# Altium project M.2 Accelerator.PrjPcb (part 1 of 2)
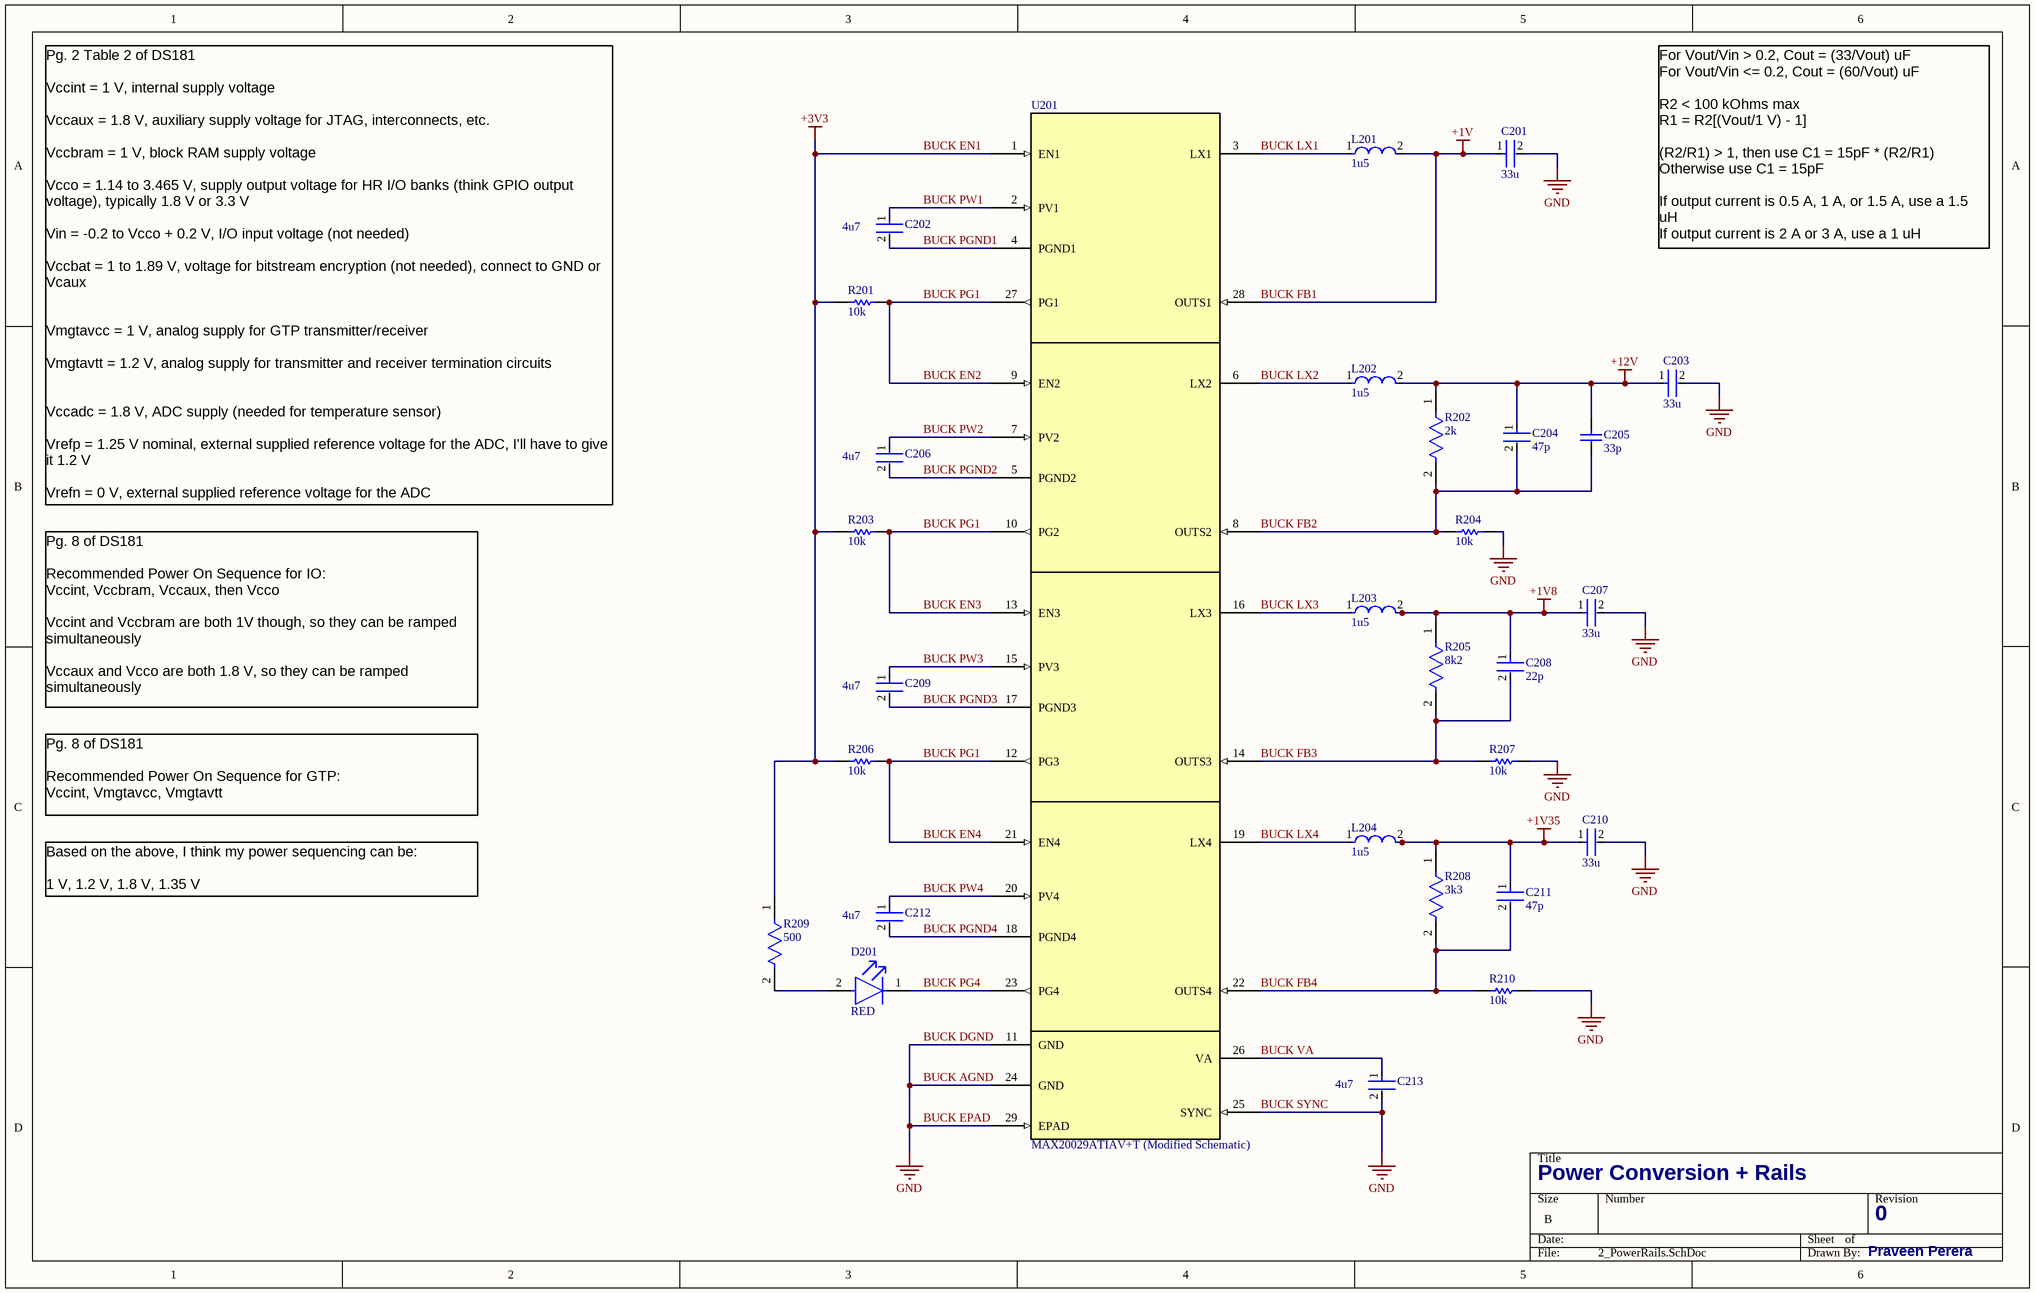
[diagram p0: 2_PowerRails.SchDoc]
9 sheets, 166 parts. Net scope: global (net labels, ports and power ports of the same name join across sheets).
Sheets:
  1_Overview.SchDoc
  2_PowerRails.SchDoc
  3_PowerDistribution.SchDoc
  4_Configuration.SchDoc
  5_GPIOBanks.SchDoc
  6_DRAMBanks.SchDoc
  7_PCIeBank.SchDoc
  8_DDR3L.SchDoc
  9_M.2_B+M.SchDoc

## Sheet 1_Overview.SchDoc
size A; SheetNumber: 1; SheetTotal: 9

## Sheet 2_PowerRails.SchDoc: Power Conversion + Rails
size B; Author: Praveen Perera; DrawnBy: Praveen Perera; Engineer: Praveen Perera; Revision: 0; SheetNumber: 2; SheetTotal: 9

### Parts
C201  33u  [FP-C2012-125-0_2-IPC_A]
C202  4u7  [FP-GCM31C-0_2-e0_3_0_8-IPC_C]
C203  33u  [FP-C2012-125-0_2-IPC_A]
C204  47p  [FP-GCQ155-0_05-MFG]
C205  33p  [CAPC1005X60X26NL10T16]
C206  4u7  [FP-GCM31C-0_2-e0_3_0_8-IPC_C]
C207  33u  [FP-C2012-125-0_2-IPC_A]
C208  22p  [FP-GJM155-0_05-IPC_A]
C209  4u7  [FP-GCM31C-0_2-e0_3_0_8-IPC_C]
C210  33u  [FP-C2012-125-0_2-IPC_A]
C211  47p  [FP-GCQ155-0_05-MFG]
C212  4u7  [FP-GCM31C-0_2-e0_3_0_8-IPC_C]
C213  4u7  [FP-GCM31C-0_2-e0_3_0_8-IPC_C]
D201  RED  [FP-SML-LX0603SIW-TR-MFG]
L201  1u5  [FP-IHLP-2525CZ-FP_2_413x3-MFG]
L202  1u5  [FP-IHLP-2525CZ-FP_2_413x3-MFG]
L203  1u5  [FP-IHLP-2525CZ-FP_2_413x3-MFG]
L204  1u5  [FP-IHLP-2525CZ-FP_2_413x3-MFG]
R201  10k  [RESC1005X40X25LL10T10]
R202  2k  [FP-MCS0402-IPC_A]
R203  10k  [RESC1005X40X25LL10T10]
R204  10k  [RESC1005X40X25LL10T10]
R205  8k2  [FP-ERA2A-MFG]
R206  10k  [RESC1005X40X25LL10T10]
R207  10k  [RESC1005X40X25LL10T10]
R208  3k3  [FP-ERA2A-MFG]
R209  500  [FP-PNM0402-MFG]
R210  10k  [RESC1005X40X25LL10T10]
U201  MAX20029ATIAV+T (Modified Schematic)  [21-0140L_T2855-5_MXM]

### Nets
+1V8: C207.1 C208.1 L203.2 R205.1
+1V35: C210.1 C211.1 L204.2 R208.1
+12V: C203.1 C204.1 C205.2 L202.2 R202.1
BUCK AGND: C201.2 C203.2 C207.2 C210.2 C213.2 R204.2 R207.2 R210.2 U201.11(GND) U201.24(GND) U201.25(SYNC) U201.29(EPAD)  [also labelled BUCK DGND, BUCK EPAD, BUCK SYNC, GND]
BUCK EN1: R201.1 R203.1 R206.1 R209.1 U201.1(EN1)  [also labelled +3V3]
BUCK FB1: C201.1 L201.2 U201.28(OUTS1)  [also labelled +1V]
BUCK EN2: R201.2 R203.2 R206.2 U201.9(EN2) U201.10(PG2) U201.12(PG3) U201.13(EN3) U201.21(EN4) U201.27(PG1)  [also labelled BUCK EN3, BUCK EN4, BUCK PG1]
BUCK FB2: C204.2 C205.1 R202.2 R204.1 U201.8(OUTS2)
BUCK FB3: C208.2 R205.2 R207.1 U201.14(OUTS3)
BUCK FB4: C211.2 R208.2 R210.1 U201.22(OUTS4)
BUCK LX1: L201.1 U201.3(LX1)
BUCK LX2: L202.1 U201.6(LX2)
BUCK LX3: L203.1 U201.16(LX3)
BUCK LX4: L204.1 U201.19(LX4)
BUCK PG4: D201.1(C) U201.23(PG4)
BUCK PGND1: C202.2 U201.4(PGND1)
BUCK PGND2: C206.2 U201.5(PGND2)
BUCK PGND3: C209.2 U201.17(PGND3)
BUCK PGND4: C212.2 U201.18(PGND4)
BUCK PW1: C202.1 U201.2(PV1)
BUCK PW2: C206.1 U201.7(PV2)
BUCK PW3: C209.1 U201.15(PV3)
BUCK PW4: C212.1 U201.20(PV4)
BUCK VA: C213.1 U201.26(VA)
NetD201_2: D201.2(A) R209.2

### Notes on the sheet
- For Vout/Vin > 0.2, Cout = (33/Vout) uF
  For Vout/Vin <= 0.2, Cout = (60/Vout) uF
  R2 < 100 kOhms max
  R1 = R2[(Vout/1 V) - 1]
  (R2/R1) > 1, then use C1 = 15pF * (R2/R1)
  Otherwise use C1 = 15pF
  If output current is 0.5 A, 1 A, or 1.5 A, use a 1.5 uH
  If output current is 2 A or 3 A, use a 1 uH
  If output voltage is less than 0.9 V, use a 0.47 uH
- Pg. 2 Table 2 of DS181
  Vccint = 1 V, internal supply voltage
  Vccaux = 1.8 V, auxiliary supply voltage for JTAG, interconnects, etc.
  Vccbram = 1 V, block RAM supply voltage
  Vcco = 1.14 to 3.465 V, supply output voltage for HR I/O banks (think GPIO output voltage), typically 1.8 V or 3.3 V
  Vin = -0.2 to Vcco + 0.2 V, I/O input voltage (not needed)
  Vccbat = 1 to 1.89 V, voltage for bitstream encryption (not needed), connect to GND or Vcaux
  Vmgtavcc = 1 V, analog supply for GTP transmitter/receiver
  Vmgtavtt = 1.2 V, analog supply for transmitter and receiver termination circuits
  Vccadc = 1.8 V, ADC supply (needed for temperature sensor)
  Vrefp = 1.25 V nominal, external supplied reference voltage for the ADC, I'll have to give it 1.2 V
  Vrefn = 0 V, external supplied reference voltage for the ADC
- Pg. 8 of DS181
  Recommended Power On Sequence for IO:
  Vccint, Vccbram, Vccaux, then Vcco
  Vccint and Vccbram are both 1V though, so they can be ramped simultaneously
  Vccaux and Vcco are both 1.8 V, so they can be ramped simultaneously
- Pg. 8 of DS181
  Recommended Power On Sequence for GTP:
  Vccint, Vmgtavcc, Vmgtavtt
- Based on the above, I think my power sequencing can be:
  1 V, 1.2 V, 1.8 V, 1.35 V

### Library data of the parts
C201 C203 C207 C210 = CMP-08246-002720-1: C2012X5R1A336M125AC / Multilayer Ceramic Capacitors 33μF ±20% 10V X5R SMD 0805; Capacitance: 33uF; Dielectric: X5R; Series: C; Packaging: Tape and Reel; Voltage Rating: 10V; Height: 1.25mm; Tolerance: 20%; Thickness: 0.057inch; Min Operating Temperature: -55°C; Max Operating Temperature: 85°C; Case Code (Imperial): 0805; Voltage Rating (DC): 10V; Case Code (Metric): 2012; Length: 2mm; REACH SVHC: No SVHC; Depth: 1.25mm; Package Quantity: 1; Dielectric Material: Ceramic; Lead Free: Lead Free; Case/Package: 0805; Termination: SMD/SMT; Resistor Type: Ceramic; RoHS Compliant: Yes; Width: 0.049inch; Weight: 0.000194oz; Mount: Surface Mount
C202 C206 C209 C212 C213 = CMP-06035-020722-1: GCM31CR71E475KA55K / Ceramic Capacitor for Automotive 4.7uF ±10% 25VDC X7R 1206 Embossed T/R; Voltage Rating: 25V; Case Code (Imperial): 1206; Depth: 1.6mm; Length: 3.2mm; Ratings: AEC-Q200; Capacitance: 4.7uF; Height: 1.6mm; Case/Package: 1206; Packaging: Tape and Reel; Radiation Hardening: No; Dielectric: X7R; Case Code (Metric): 3216; Termination: SMD/SMT; Package Quantity: 6000; Max Operating Temperature: 125°C; Voltage Rating (DC): 25V; Thickness: 0.071inch; Width: 0.063inch; Min Operating Temperature: -55°C; Mount: Surface Mount; Tolerance: 10%
C204 C211 = CMP-06035-040611-1: GCQ1555C1H470GB01D / High Q Ceramic Capacitor for Automotive 47pF ±2% 50VDC C0G 0402 Paper T/R
C205 = CMP-2008-01050-1: VJ0402A330JXAAC; Manufacturer: Vitramon; Part Number: VJ0402A330JXAAC
C208 = CMP-06035-061679-1: GJM1555C1H220GB01D / Multi-Layer Ceramic Capacitor 22pF C0G  ±2% 0402 Paper T/R; Voltage Rating (DC): 50V; Length: 1mm; Thickness: 500um; Tolerance: 2%; Capacitance: 22pF; RoHS Compliant: Yes; Dielectric: C0G; Width: 500um
D201 = CMP-57192-000009-1: SML-LX0603SIW-TR / LED RED DIFFUSED SMD; Test Current: 20mA; Forward Voltage: 2V; Approvals: UL; Dominant Wavelength: 636nm; Viewing Angle: 140°; Lens Color: White; Luminous Intensity: 60mcd; Power Rating: 50mW; Number of LEDs: 1; Color: Red; Forward Current: 20mA; Moisture Sensitivity Level: 2; Case Code (Imperial): 0603; Lead Free: Lead Free; Lens Transparency: Diffused; Case Code (Metric): 1608; Height: 0.6mm; Max Operating Temperature: 85°C; Width: 0.8mm; Lens Style: Diffused; Illumination Color: Red; Wavelength: 636nm; REACH SVHC: No SVHC; Package Quantity: 1; RoHS Compliant: Yes; Case/Package: 0603; Number of Pins: 2; Packaging: Tape and Reel; Length: 1.6mm; Mount: Surface Mount; Min Operating Temperature: -25°C
L201-L204 = CMP-02424-000713-1: IHLP2525CZER1R5M07 / Commercial Inductors, High Saturation Series, 5 % DCR Tolerance 1.5uH 9A 14.5mΩ 20%; DC Resistance (DCR): 14.5mR; Saturation Current: 18A; Test Frequency: 100kHz; Shielding: Shielded; Lead Free: Lead Free; Tolerance: 20%; Radiation Hardening: No; Series: IHLP-2525CZ-07; Width: 0.255inch; Length: 0.27inch; Depth: 6.72mm; Case/Package: Nonstandard; Height: 3mm; Mount: Surface Mount; Package Quantity: 2000; Current Rating: 9A; Height - Seated (Max): 0.118inch; Packaging: Tape and Reel; Inductance: 1.5uH; Max Operating Temperature: 125°C; Min Operating Temperature: -55°C
R201 R203 R204 R206 R207 R210 = CMP-2002-04584-1: SG73P1ETTP1002F; Manufacturer: KOA Speer; Part Number: SG73P1ETTP1002F
R202 = CMP-02407-003721-1: MCS0402MD2001BE100 / RES SMD 1.2K OHM 1% 1/10W 0402; Resistance: 2kR; Temperature Coefficient: 25ppm/°C; Power Rating: 63mW; Voltage Rating: 50V; Tolerance: 0.1%; Lead Free: Lead Free; Max Operating Temperature: 155°C; Case/Package: 0402; Case Code (Metric): 1005; Height: 0.32mm; Composition: Thin Film; Weight: 2.1E-05oz; Width: 0.5mm; Case Code (Imperial): 0402; Packaging: Tape and Reel; Length: 1mm; Min Operating Temperature: -55°C; Contact Plating: Tin
R205 = CMP-2002-05828-2: ERA-2AEB822X / RES SMD 8.2K OHM 0.1% 1/16W 0402; Manufacturer: Panasonic Electronic Components; Value: 8.2kΩ; Temperature Coefficient: 25ppm/°C; Voltage Rating: 50V; Automotive Grade: Grade 0; Power Rating: 0.063W; Temperature Range Low: -55°C; Lead Free: Yes; Device Class L2: Resistors; Height: 0.4mm; RoHS: TRUE; Mouser Description: Thin Film Resistors - SMD 0402 1/16W 8.2Kohms; Octopart: https://octopart.com/era-2aeb822x-panasonic-43284358; Tolerance: 0.1%; Composition: Thin Film; Package: ERA2A; Resistance: 8.2kΩ; Temperature: -55°C to +155°C; Series: ERA; Manufacturer Part Number: ERA-2AEB822X; ComponentLink2URL: https://industrial.panasonic.com/cdbs/www-data/pdf/RDM0000/AOA0000C307.pdf; Digikey Description: RES SMD 8.2K OHM 0.1% 1/16W 0402; ComponentLink2Description: Datasheet; Category: Res; Footprint Url: https://industrial.panasonic.com/cdbs/www-data/pdf/RDM0000/DMM0000COL17.pdf; Temperature Range High: +155°C; Automotive: Yes; Device Class L1: Passive Components; Device Class L3: Chip SMD Resistors
R208 = CMP-2002-05884-2: ERA-2AEB332X; NexarPartId: 9251384; Voltage Rating (DC): 25V; Temperature Coefficient: 25ppm/°C; Tolerance: 0.1%; Resistance: 3.3kΩ; Power Rating: 63mW; Case/Package: 0402; Number of Terminations: 2; Military Standard: Not; Case Code (Imperial): 0402; Length: 1mm; Contact Plating: Tin; Termination: SMD/SMT; Schedule B: 8533210045, 8533210045; Voltage Rating: 25V; Lead Free: Lead Free; Min Operating Temperature: -55°C; REACH SVHC: No SVHC; Max Power Dissipation: 63mW; Weight: 793.786648µg; RoHS: Compliant; Depth: 500µm; Packaging: Cut Tape; Max Operating Temperature: 155°C; Width: 500µm; Case Code (Metric): 1005; Height: 350µm; Composition: Thin Film; Lifecycle Status: Production; Radiation Hardening: No; Number of Pins: 2; Mount: Surface Mount
R209 = CMP-02407-011888-1: PNM0402E5000BST1 / RES SMD 500 OHM 0.1% 1/20W 0402; Temperature Coefficient: 25ppm/°C; Max Power Dissipation: 50mW; Resistance: 500R; Width: 0.022inch; Length: 0.042inch; Tolerance: 0.1%; Lead Free: Lead Free; Height: 0.033inch; Case Code (Metric): 1005; Features: Moisture Resistant; Case Code (Imperial): 0402; Max Operating Temperature: 155°C; Case/Package: 0402; Min Operating Temperature: -55°C; Package Quantity: 1000; RoHS Compliant: Yes; Packaging: Tape and Reel; Resistor Type: Thin Film; Number of Terminations: 2
U201 = CMP-010-000006-2: Automotive Quad/Triple Low-Voltage Step-Down DC-DC Converters; Manufacturer_Name: Analog Devices / Maxim Integrated; Manufacturer_Part_Number: MAX20029ATIA/V+T; Source: MAX20029ATIAV&plus_T - Modified.SchLib; RefDes: RefDes; Design Item ID: MAX20029ATIAV+T; Copyright: Copyright (C) 2025 Ultra Librarian. All rights reserved.; Pin Count: 29; Component Type: Standard; Type: Type

## Sheet 3_PowerDistribution.SchDoc
size A3; SheetNumber: 3; SheetTotal: 8
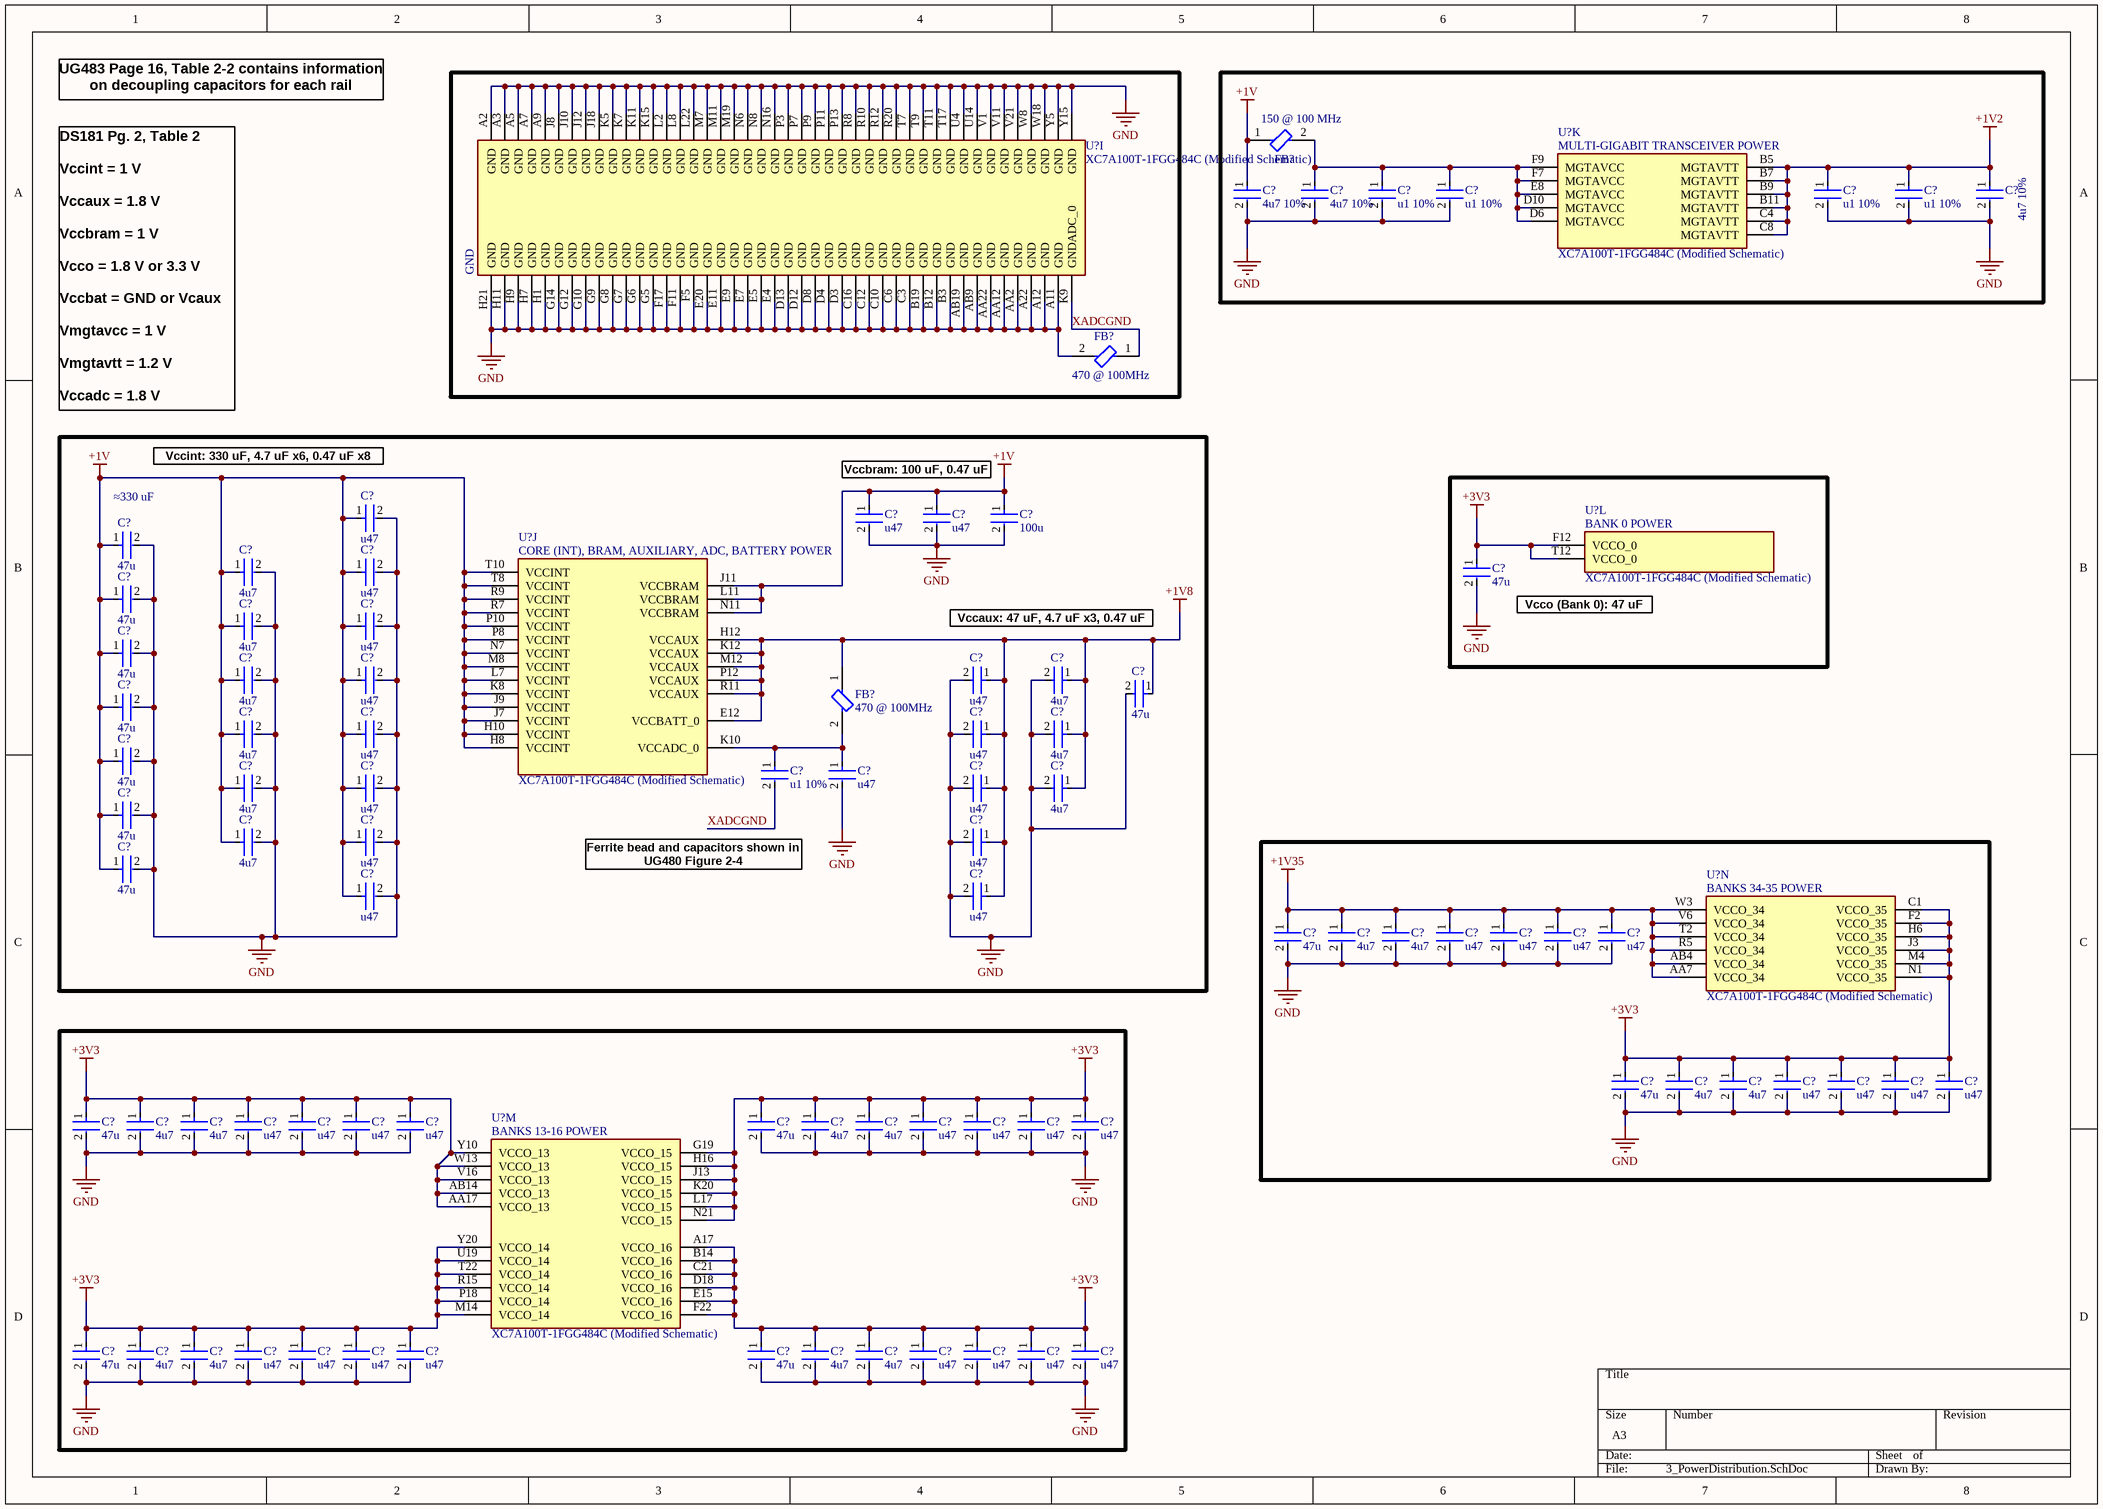
[diagram p1: 3_PowerDistribution.SchDoc]

### Parts
(Parts that share a designator on the sheet are numbered #1, #2 ... from top to bottom, then left to right.)
C?#1  4u7 10%  [FP-C1005-050-0_20-0_10-MFG]
C?#2  4u7 10%  [FP-C1005-050-0_20-0_10-MFG]
C?#3  u1 10%  [FP-CL891-IPC_C]
C?#4  u1 10%  [FP-CL891-IPC_C]
C?#5  u1 10%  [FP-CL891-IPC_C]
C?#6  u1 10%  [FP-CL891-IPC_C]
C?#7  4u7 10%  [FP-C1005-050-0_20-0_10-MFG]
C?#8  u47  [FP-C0603-030-0_03-IPC_A]
C?#9  u47  [FP-C0603-030-0_03-IPC_A]
C?#10  100u  [FP-GRM21B-0_2-e0_2_0_7-IPC_A]
C?#11  u47  [FP-C0603-030-0_03-IPC_A]
C?#12  47u  [FP-GRM188-0_2-IPC_B]
C?#13  47u  [FP-GRM188-0_2-IPC_B]
C?#14  4u7  [FP-CL829-IPC_C]
C?#15  u47  [FP-C0603-030-0_03-IPC_A]
C?#16  47u  [FP-GRM188-0_2-IPC_B]
C?#17  4u7  [FP-CL829-IPC_C]
C?#18  u47  [FP-C0603-030-0_03-IPC_A]
C?#19  47u  [FP-GRM188-0_2-IPC_B]
C?#20  4u7  [FP-CL829-IPC_C]
C?#21  u47  [FP-C0603-030-0_03-IPC_A]
C?#22  u47  [FP-C0603-030-0_03-IPC_A]
C?#23  4u7  [FP-CL829-IPC_C]
C?#24  47u  [FP-GRM188-0_2-IPC_B]
C?#25  47u  [FP-GRM188-0_2-IPC_B]
C?#26  4u7  [FP-CL829-IPC_C]
C?#27  u47  [FP-C0603-030-0_03-IPC_A]
C?#28  u47  [FP-C0603-030-0_03-IPC_A]
C?#29  4u7  [FP-CL829-IPC_C]
C?#30  47u  [FP-GRM188-0_2-IPC_B]
C?#31  u1 10%  [FP-CL891-IPC_C]
C?#32  u47  [FP-C0603-030-0_03-IPC_A]
C?#33  4u7  [FP-CL829-IPC_C]
C?#34  u47  [FP-C0603-030-0_03-IPC_A]
C?#35  u47  [FP-C0603-030-0_03-IPC_A]
C?#36  4u7  [FP-CL829-IPC_C]
C?#37  47u  [FP-GRM188-0_2-IPC_B]
C?#38  4u7  [FP-CL829-IPC_C]
C?#39  u47  [FP-C0603-030-0_03-IPC_A]
C?#40  u47  [FP-C0603-030-0_03-IPC_A]
C?#41  47u  [FP-GRM188-0_2-IPC_B]
C?#42  u47  [FP-C0603-030-0_03-IPC_A]
C?#43  u47  [FP-C0603-030-0_03-IPC_A]
C?#44  47u  [FP-GRM188-0_2-IPC_B]
C?#45  4u7  [FP-CL829-IPC_C]
C?#46  4u7  [FP-CL829-IPC_C]
C?#47  u47  [FP-C0603-030-0_03-IPC_A]
C?#48  u47  [FP-C0603-030-0_03-IPC_A]
C?#49  u47  [FP-C0603-030-0_03-IPC_A]
C?#50  u47  [FP-C0603-030-0_03-IPC_A]
C?#51  47u  [FP-GRM188-0_2-IPC_B]
C?#52  4u7  [FP-CL829-IPC_C]
C?#53  4u7  [FP-CL829-IPC_C]
C?#54  u47  [FP-C0603-030-0_03-IPC_A]
C?#55  u47  [FP-C0603-030-0_03-IPC_A]
C?#56  u47  [FP-C0603-030-0_03-IPC_A]
C?#57  u47  [FP-C0603-030-0_03-IPC_A]
C?#58  47u  [FP-GRM188-0_2-IPC_B]
C?#59  4u7  [FP-CL829-IPC_C]
C?#60  4u7  [FP-CL829-IPC_C]
C?#61  u47  [FP-C0603-030-0_03-IPC_A]
C?#62  u47  [FP-C0603-030-0_03-IPC_A]
C?#63  u47  [FP-C0603-030-0_03-IPC_A]
C?#64  u47  [FP-C0603-030-0_03-IPC_A]
C?#65  47u  [FP-GRM188-0_2-IPC_B]
C?#66  4u7  [FP-CL829-IPC_C]
C?#67  4u7  [FP-CL829-IPC_C]
C?#68  u47  [FP-C0603-030-0_03-IPC_A]
C?#69  u47  [FP-C0603-030-0_03-IPC_A]
C?#70  u47  [FP-C0603-030-0_03-IPC_A]
C?#71  u47  [FP-C0603-030-0_03-IPC_A]
C?#72  47u  [FP-GRM188-0_2-IPC_B]
C?#73  4u7  [FP-CL829-IPC_C]
C?#74  4u7  [FP-CL829-IPC_C]
C?#75  u47  [FP-C0603-030-0_03-IPC_A]
C?#76  u47  [FP-C0603-030-0_03-IPC_A]
C?#77  u47  [FP-C0603-030-0_03-IPC_A]
C?#78  u47  [FP-C0603-030-0_03-IPC_A]
C?#79  47u  [FP-GRM188-0_2-IPC_B]
C?#80  4u7  [FP-CL829-IPC_C]
C?#81  4u7  [FP-CL829-IPC_C]
C?#82  u47  [FP-C0603-030-0_03-IPC_A]
C?#83  u47  [FP-C0603-030-0_03-IPC_A]
C?#84  u47  [FP-C0603-030-0_03-IPC_A]
C?#85  u47  [FP-C0603-030-0_03-IPC_A]
FB?#1  150 @ 100 MHz  [FP-MPZ1005-IPC_B]
FB?#2  470 @ 100MHz  [FP-BLM41-0_2-a1_2-IPC_B]
FB?#3  470 @ 100MHz  [FP-BLM41-0_2-a1_2-IPC_B]
U?#1  XC7A100T-1FGG484C (Modified Schematic)  [BGA484C100P22X22_2300X2300X260N]  (part I of 14)
U?#2  XC7A100T-1FGG484C (Modified Schematic)  [BGA484C100P22X22_2300X2300X260N]  (part K of 14)
U?#3  XC7A100T-1FGG484C (Modified Schematic)  [BGA484C100P22X22_2300X2300X260N]  (part L of 14)
U?#4  XC7A100T-1FGG484C (Modified Schematic)  [BGA484C100P22X22_2300X2300X260N]  (part J of 14)
U?#5  XC7A100T-1FGG484C (Modified Schematic)  [BGA484C100P22X22_2300X2300X260N]  (part N of 14)
U?#6  XC7A100T-1FGG484C (Modified Schematic)  [BGA484C100P22X22_2300X2300X260N]  (part M of 14)

### Blocks framed on the sheet
≈330 uF: C?#8-C?#12 C?#14-C?#43 FB?#3 U?#4

### Nets
+1V: C?#1.1 C?#8.1 C?#9.1 C?#10.1 C?#11.1 C?#12.1 C?#14.1 C?#15.1 C?#16.1 C?#17.1 C?#18.1 C?#19.1 C?#20.1 C?#21.1 C?#25.1 C?#26.1 C?#27.1 C?#30.1 C?#33.1 C?#34.1 C?#37.1 C?#38.1 C?#39.1 C?#41.1 C?#42.1 FB?#1.1 U?#4.H8(VCCINT) U?#4.H10(VCCINT) U?#4.J7(VCCINT) U?#4.J9(VCCINT) U?#4.J11(VCCBRAM) U?#4.K8(VCCINT) U?#4.L7(VCCINT) U?#4.L11(VCCBRAM) U?#4.M8(VCCINT) U?#4.N7(VCCINT) U?#4.N11(VCCBRAM) U?#4.P8(VCCINT) U?#4.P10(VCCINT) U?#4.R7(VCCINT) U?#4.R9(VCCINT) U?#4.T8(VCCINT) U?#4.T10(VCCINT)  [project net BUCK FB1]
+1V2: C?#5.1 C?#6.1 C?#7.1 U?#2.B5(MGTAVTT) U?#2.B7(MGTAVTT) U?#2.B9(MGTAVTT) U?#2.B11(MGTAVTT) U?#2.C4(MGTAVTT) U?#2.C8(MGTAVTT)
+1V8: C?#22.1 C?#23.1 C?#24.1 C?#28.1 C?#29.1 C?#35.1 C?#36.1 C?#40.1 C?#43.1 FB?#3.1 U?#4.E12(VCCBATT_0) U?#4.H12(VCCAUX) U?#4.K12(VCCAUX) U?#4.M12(VCCAUX) U?#4.P12(VCCAUX) U?#4.R11(VCCAUX)
+1V35: C?#44.1 C?#45.1 C?#46.1 C?#47.1 C?#48.1 C?#49.1 C?#50.1 U?#5.AA7(VCCO_34) U?#5.AB4(VCCO_34) U?#5.R5(VCCO_34) U?#5.T2(VCCO_34) U?#5.V6(VCCO_34) U?#5.W3(VCCO_34)
+3V3: C?#13.1 C?#51.1 C?#52.1 C?#53.1 C?#54.1 C?#55.1 C?#56.1 C?#57.1 C?#58.1 C?#59.1 C?#60.1 C?#61.1 C?#62.1 C?#63.1 C?#64.1 C?#65.1 C?#66.1 C?#67.1 C?#68.1 C?#69.1 C?#70.1 C?#71.1 C?#72.1 C?#73.1 C?#74.1 C?#75.1 C?#76.1 C?#77.1 C?#78.1 C?#79.1 C?#80.1 C?#81.1 C?#82.1 C?#83.1 C?#84.1 C?#85.1 U?#3.F12(VCCO_0) U?#3.T12(VCCO_0) U?#5.C1(VCCO_35) U?#5.F2(VCCO_35) U?#5.H6(VCCO_35) U?#5.J3(VCCO_35) U?#5.M4(VCCO_35) U?#5.N1(VCCO_35) U?#6.A17(VCCO_16) U?#6.AA17(VCCO_13) U?#6.AB14(VCCO_13) U?#6.B14(VCCO_16) U?#6.C21(VCCO_16) U?#6.D18(VCCO_16) U?#6.E15(VCCO_16) U?#6.F22(VCCO_16) U?#6.G19(VCCO_15) U?#6.H16(VCCO_15) U?#6.J13(VCCO_15) U?#6.K20(VCCO_15) U?#6.L17(VCCO_15) U?#6.M14(VCCO_14) U?#6.N21(VCCO_15) U?#6.P18(VCCO_14) U?#6.R15(VCCO_14) U?#6.T22(VCCO_14) U?#6.U19(VCCO_14) U?#6.V16(VCCO_13) U?#6.W13(VCCO_13) U?#6.Y10(VCCO_13) U?#6.Y20(VCCO_14)  [project net BUCK EN1]
GND: C?#1.2 C?#2.2 C?#3.2 C?#4.2 C?#5.2 C?#6.2 C?#7.2 C?#8.2 C?#9.2 C?#10.2 C?#11.2 C?#12.2 C?#13.2 C?#14.2 C?#15.2 C?#16.2 C?#17.2 C?#18.2 C?#19.2 C?#20.2 C?#21.2 C?#22.2 C?#23.2 C?#24.2 C?#25.2 C?#26.2 C?#27.2 C?#28.2 C?#29.2 C?#30.2 C?#32.2 C?#33.2 C?#34.2 C?#35.2 C?#36.2 C?#37.2 C?#38.2 C?#39.2 C?#40.2 C?#41.2 C?#42.2 C?#43.2 C?#44.2 C?#45.2 C?#46.2 C?#47.2 C?#48.2 C?#49.2 C?#50.2 C?#51.2 C?#52.2 C?#53.2 C?#54.2 C?#55.2 C?#56.2 C?#57.2 C?#58.2 C?#59.2 C?#60.2 C?#61.2 C?#62.2 C?#63.2 C?#64.2 C?#65.2 C?#66.2 C?#67.2 C?#68.2 C?#69.2 C?#70.2 C?#71.2 C?#72.2 C?#73.2 C?#74.2 C?#75.2 C?#76.2 C?#77.2 C?#78.2 C?#79.2 C?#80.2 C?#81.2 C?#82.2 C?#83.2 C?#84.2 C?#85.2 FB?#2.2 U?#1.A2(GND) U?#1.A3(GND) U?#1.A5(GND) U?#1.A7(GND) U?#1.A9(GND) U?#1.A11(GND) U?#1.A12(GND) U?#1.A22(GND) U?#1.AA2(GND) U?#1.AA12(GND) U?#1.AA22(GND) U?#1.AB9(GND) U?#1.AB19(GND) U?#1.B3(GND) U?#1.B12(GND) U?#1.B19(GND) U?#1.C3(GND) U?#1.C6(GND) U?#1.C10(GND) U?#1.C12(GND) U?#1.C16(GND) U?#1.D3(GND) U?#1.D4(GND) U?#1.D8(GND) U?#1.D12(GND) U?#1.D13(GND) U?#1.E4(GND) U?#1.E5(GND) U?#1.E7(GND) U?#1.E9(GND) U?#1.E11(GND) U?#1.E20(GND) U?#1.F5(GND) U?#1.F11(GND) U?#1.F17(GND) U?#1.G5(GND) U?#1.G6(GND) U?#1.G7(GND) U?#1.G8(GND) U?#1.G9(GND) U?#1.G10(GND) U?#1.G12(GND) U?#1.G14(GND) U?#1.H1(GND) U?#1.H7(GND) U?#1.H9(GND) U?#1.H11(GND) U?#1.H21(GND) U?#1.J8(GND) U?#1.J10(GND) U?#1.J12(GND) U?#1.J18(GND) U?#1.K5(GND) U?#1.K7(GND) U?#1.K11(GND) U?#1.K15(GND) U?#1.L2(GND) U?#1.L8(GND) U?#1.L22(GND) U?#1.M7(GND) U?#1.M11(GND) U?#1.M19(GND) U?#1.N6(GND) U?#1.N8(GND) U?#1.N16(GND) U?#1.P3(GND) U?#1.P7(GND) U?#1.P9(GND) U?#1.P11(GND) U?#1.P13(GND) U?#1.R8(GND) U?#1.R10(GND) U?#1.R12(GND) U?#1.R20(GND) U?#1.T7(GND) U?#1.T9(GND) U?#1.T11(GND) U?#1.T17(GND) U?#1.U4(GND) U?#1.U14(GND) U?#1.V1(GND) U?#1.V11(GND) U?#1.V21(GND) U?#1.W8(GND) U?#1.W18(GND) U?#1.Y5(GND) U?#1.Y15(GND)  [project net BUCK AGND]
XADCGND: C?#31.2 FB?#2.1 U?#1.K9(GNDADC_0)
NetC?#2_1: C?#2.1 C?#3.1 C?#4.1 FB?#1.2 U?#2.D6(MGTAVCC) U?#2.D10(MGTAVCC) U?#2.E8(MGTAVCC) U?#2.F7(MGTAVCC) U?#2.F9(MGTAVCC)
NetC?#31_1: C?#31.1 C?#32.1 FB?#3.2 U?#4.K10(VCCADC_0)

### Notes on the sheet
- UG483 Page 16, Table 2-2 contains information on decoupling capacitors for each rail
- DS181 Pg. 2, Table 2
  Vccint = 1 V
  Vccaux = 1.8 V
  Vccbram = 1 V
  Vcco = 1.8 V or 3.3 V
  Vccbat = GND or Vcaux
  Vmgtavcc = 1 V
  Vmgtavtt = 1.2 V
  Vccadc = 1.8 V
- Vccint: 330 uF, 4.7 uF x6, 0.47 uF x8
- (near C?#9) Vccbram: 100 uF, 0.47 uF x2
- Vccaux: 47 uF, 4.7 uF x3, 0.47 uF x5
- Vcco (Bank 0): 47 uF
- Ferrite bead and capacitors shown in UG480 Figure 2-4
- (in symbol XC7A100T-1FGG484C, part J) CORE (INT), BRAM, AUXILIARY, ADC, BATTERY POWER
- (in symbol XC7A100T-1FGG484C, part K) MULTI-GIGABIT TRANSCEIVER POWER
- (in symbol XC7A100T-1FGG484C, part L) BANK 0 POWER
- (in symbol XC7A100T-1FGG484C, part M) BANKS 13-16 POWER
- (in symbol XC7A100T-1FGG484C, part N) BANKS 34-35 POWER

### Library data of the parts
C?#1 C?#2 C?#7 = CMP-08246-007228-1: C1005X5R1A475K050BE / CAP CER 4.7UF 10V X5R 0402; Max Operating Temperature: 85°C; Case Code (Metric): 1005; Voltage Rating: 10V; Tolerance: 10%; Packaging: Tape and Reel; Capacitance: 4.7uF; Case/Package: 0402; Features: Soft Termination; Min Operating Temperature: -55°C; Mount: Surface Mount; Case Code (Imperial): 0402; RoHS Compliant: Yes
C?#3-C?#6 C?#31 = CMP-13271-001945-1: CL05B104KB5NNNC / Cap Ceramic 100nF 50V X7R ±10% SMD 0402 +125°C Paper T/R
C?#8 C?#9 C?#11 C?#15 C?#18 C?#21 C?#22 C?#27 C?#28 C?#32 C?#34 C?#35 C?#39 C?#40 C?#42 C?#43 C?#47-C?#50 C?#54-C?#57 C?#61-C?#64 C?#68-C?#71 C?#75-C?#78 C?#82-C?#85 = CMP-08246-006895-1: C0603X5R1A474M030BC / Multilayer Ceramic Capacitors 470nF ±20% 10V X5R SMD 0201; Package Quantity: 1; Mount: Surface Mount; RoHS Compliant: Yes; Case/Package: 0201; Case Code (Metric): 0603; Max Operating Temperature: 85°C; Series: C; Min Operating Temperature: -55°C; Length: 0.024inch; Dielectric Material: Ceramic; REACH SVHC: No SVHC; Lead Free: Lead Free; Case Code (Imperial): 0201; Width: 0.012inch; Dielectric: X5R; Capacitance: 470nF; Tolerance: 20%; Thickness: 0.013inch; Voltage Rating: 10V; Packaging: Cut Tape; Voltage Rating (DC): 10V
C?#10 = CMP-2000-07599-2: GRM21BR60J107ME15L / Chip Multilayer Ceramic Capacitors for General Purpose, 0805, 100uF, X5R, 15%, 20%, 6.3V; Length: 0.079inch; Dielectric: X5R; Case Code (Metric): 2012; Max Operating Temperature: 85°C; Voltage Rating (DC): 6.3V; Min Operating Temperature: -55°C; Tolerance: 20%; Packaging: Cut Tape; Voltage Rating: 6.3V; Capacitance: 100uF; REACH SVHC: No SVHC; Width: 0.049inch; Mount: Surface Mount; Case/Package: 0805; Case Code (Imperial): 0805; Lead Free: Lead Free; Thickness: 0.057inch
C?#12 C?#13 C?#16 C?#19 C?#24 C?#25 C?#30 C?#37 C?#41 C?#44 C?#51 C?#58 C?#65 C?#72 C?#79 = CMP-2000-05444-2: GRM188R60J476ME15D / Chip Multilayer Ceramic Capacitors for General Purpose, 0603, 47uF, X5R, 15%, 20%, 6.3V; Voltage Rating (DC): 6.3V; Thickness: 0.039inch; Case Code (Imperial): 0603; Packaging: Tape and Reel; Capacitance: 47uF; Width: 0.031inch; Dielectric: X5R; Max Operating Temperature: 85°C; Mount: Surface Mount; Case Code (Metric): 1608; Length: 0.063inch; Voltage Rating: 6.3V; Tolerance: 20%; Case/Package: 0603; Min Operating Temperature: -55°C
C?#14 C?#17 C?#20 C?#23 C?#26 C?#29 C?#33 C?#36 C?#38 C?#45 C?#46 C?#52 C?#53 C?#59 C?#60 C?#66 C?#67 C?#73 C?#74 C?#80 C?#81 = CMP-13271-001468-1: CL05A475MO5NUNC / Cap Ceramic 4.7uF 16V X5R ±20% SMD 0402 +85°C Paper T/R; Mount: Surface Mount; Case Code (Metric): 1005; Case/Package: 0402; Length: 0.039inch; Capacitance: 4.7uF; Voltage Rating: 16V; Max Operating Temperature: 85°C; Tolerance: 20%; Thickness: 0.022inch; Min Operating Temperature: -55°C; Case Code (Imperial): 0402; Packaging: Tape and Reel; Width: 0.02inch
FB?#1 = CMP-08257-000209-1: MPZ1005A151ETD25 / Power line Ferrite Bead 150Ω @ 100MHz 0.8A DCR 0.18Ω AEC-Q200 SMD 0402; RoHS Compliant: Yes
FB?#2 FB?#3 = CMP-0686-00760-3: BLM41PG471SN1L / Ferrite Bead, 1806, 470Ω @ 100MHz, 25%, 0.05Ω, 2A; Material: Steel; Number of Circuits: 1; Shielding: Unshielded; DC Resistance (DCR): 50mR; Impedance: 470R; Min Operating Temperature: -55°C; Case/Package: 1806; Packaging: Tape and Reel; DC Current: 2A; Frequency: 100MHz; Length: 4.5mm; Max Operating Temperature: 125°C; Package Quantity: 1; Max Current Rating: 2A; Radiation Hardening: No; RoHS Compliant: Yes; Lead Free: Lead Free; Height: 1.6mm; Test Frequency: 100MHz; Series: BLM41P; Width: 1.6mm; Core Material: Ferrite; Case Code (Imperial): 1806; Termination: SMD/SMT; Tolerance: 25%; Number of Pins: 2; Number of Lines: 1; Case Code (Metric): 4516; Current Rating: 2A; Max DC Current: 2A; DC Resistance-Max: 50mR; Depth: 1.6mm; Military Standard: Not
U?#1-U?#6 = XC7A100T-1FGG484C: Artix-7 Field Programmable Gate Array (FPGA) IC 285 4976640 101440 484-BBGA; MF: Xilinx Inc.; Check_prices: https://www.snapeda.com/parts/XC7A100T-1FGG484C/Xilinx/view-part/?ref=eda; MP: XC7A100T-1FGG484C; Package: FBGA-484 Xilinx; SnapEDA_Link: https://www.snapeda.com/parts/XC7A100T-1FGG484C/Xilinx/view-part/?ref=snap; Value: *

## Sheet 4_Configuration.SchDoc: FPGA Configuration
size Legal; Author: Praveen Perera; DrawnBy: Praveen Perera; Engineer: Praveen Perera; Revision: 0; SheetNumber: 4; SheetTotal: 9; Time: 12/26/2025
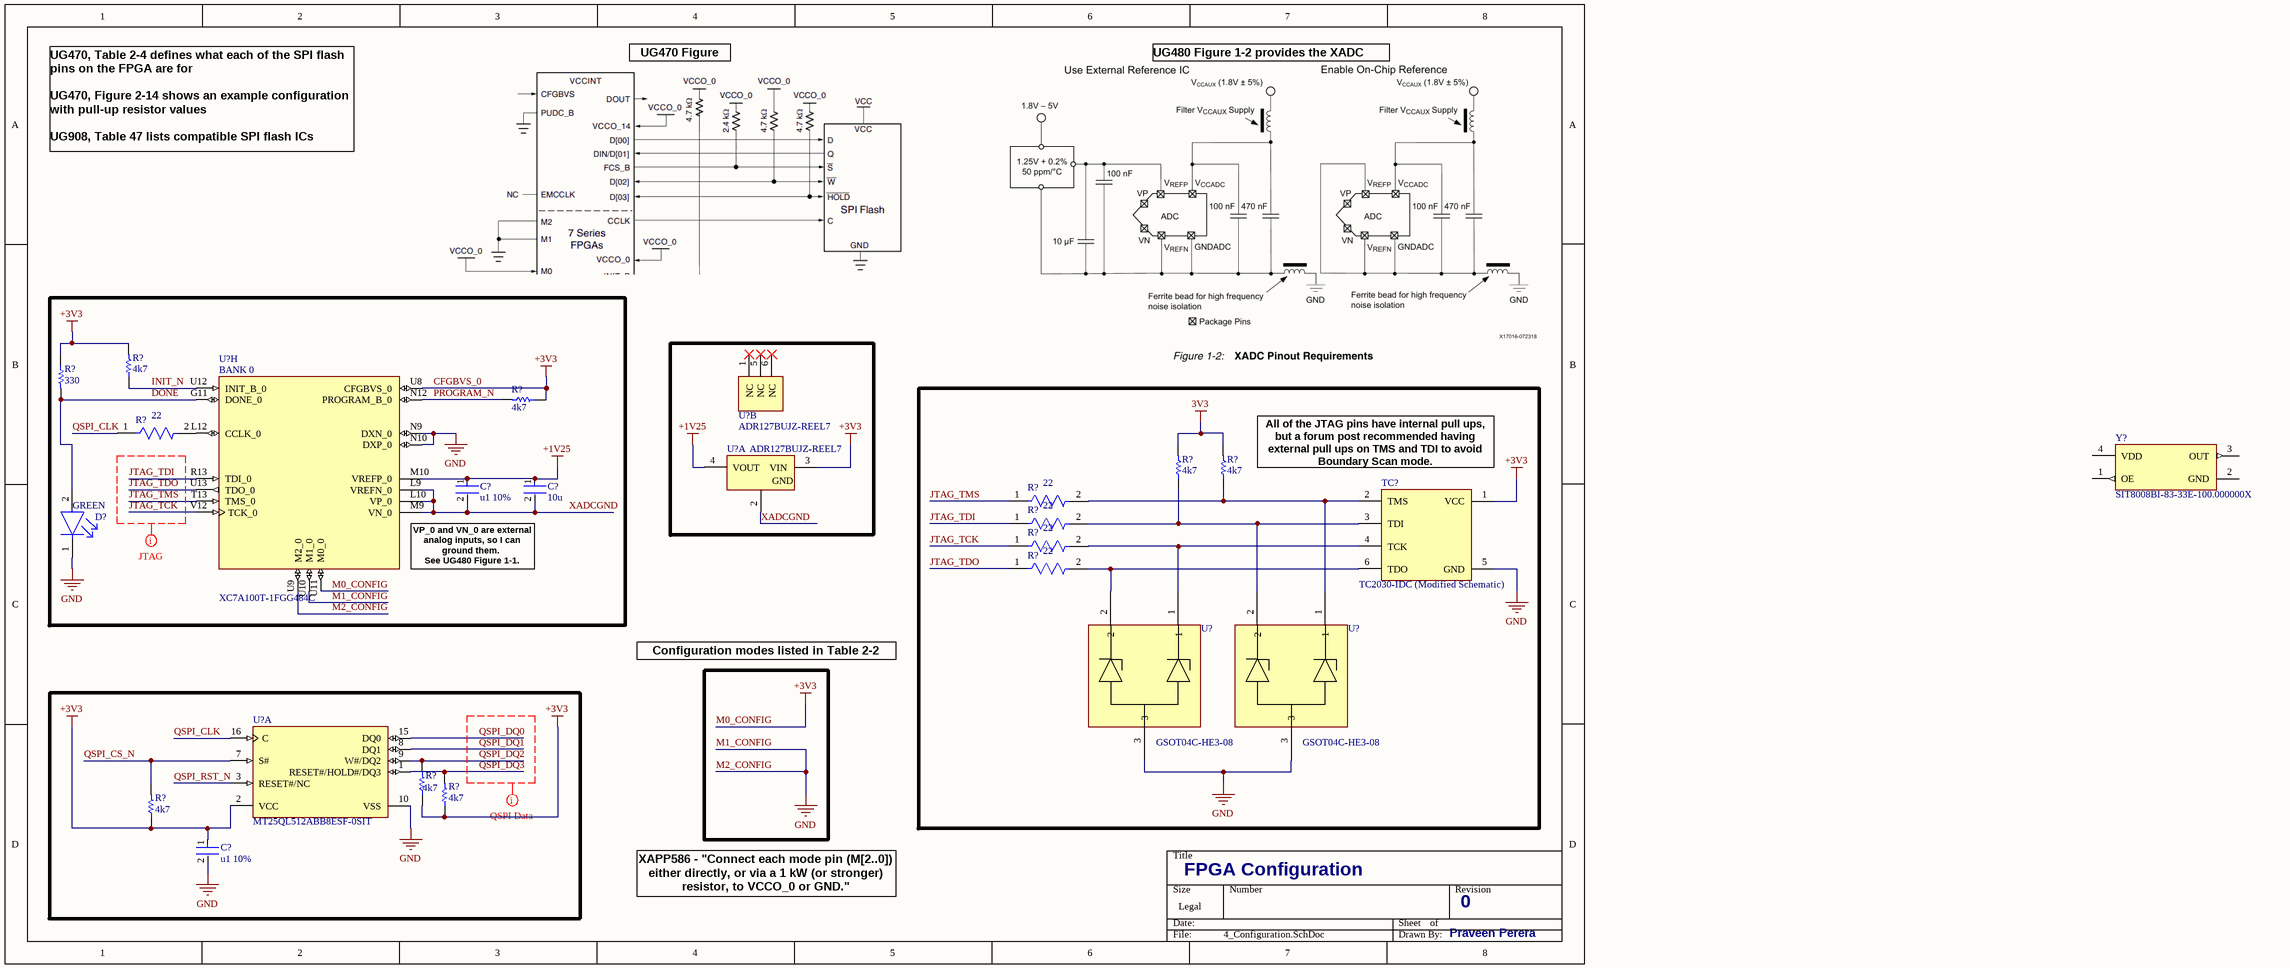
[diagram p2: 4_Configuration.SchDoc]

### Parts
(Parts that share a designator on the sheet are numbered #1, #2 ... from top to bottom, then left to right.)
C?#86  u1 10%  [FP-CL891-IPC_C]
C?#87  10u  [FP-CL05A106MP5NUNC-MFG]
C?#88  u1 10%  [FP-CL891-IPC_C]
D?  GREEN  [FP-SML-D12-MFG]
R?#1  330  [RESC0201(0603)_M]
R?#2  4k7  [RESC0603X28X15NL05T05]
R?#3  4k7  [RESC0603X28X15NL05T05]
R?#4  22  [FP-RMCF0201-IPC_C]
R?#5  4k7  [RESC0603X28X15NL05T05]
R?#6  4k7  [RESC0603X28X15NL05T05]
R?#7  22  [FP-RMCF0201-IPC_C]
R?#8  22  [FP-RMCF0201-IPC_C]
R?#9  22  [FP-RMCF0201-IPC_C]
R?#10  22  [FP-RMCF0201-IPC_C]
R?#11  4k7  [RESC0603X28X15NL05T05]
R?#12  4k7  [RESC0603X28X15NL05T05]
R?#13  4k7  [RESC0603X28X15NL05T05]
TC?  TC2030-IDC (Modified Schematic)  [*TC2030-IDC]
U?#7  ADR127BUJZ-REEL7  [ADI-UJ-6_M]  (part B of 2)
U?#8  ADR127BUJZ-REEL7  [ADI-UJ-6_M]  (part A of 2)
U?#9  XC7A100T-1FGG484C  [BGA484C100P22X22_2300X2300X260N]  (part H of 14)
U?#10  GSOT04C-HE3-08  [SOT_C-HE3-08_VIS]
U?#11  GSOT04C-HE3-08  [SOT_C-HE3-08_VIS]
U?#12  MT25QL512ABB8ESF-0SIT  [MICT-SF-16_L]  (part A of 2)
Y?#1  SIT8008BI-83-33E-100.000000X  [FP-SiT8008-8-MFG]

### Nets
3V3: R?#5.2 R?#6.2
+1V25: C?#86.1 C?#87.1 U?#8.4(VOUT) U?#9.M10(VREFP_0)
+3V3: C?#88.1 R?#1.1 R?#2.2 R?#3.1 R?#11.1 R?#12.1 R?#13.1 TC?.1(VCC) U?#8.3(VIN) U?#9.U8(CFGBVS_0) U?#9.U11(M0_0) U?#12.2(VCC)  [also labelled CFGBVS_0, M0_CONFIG]  [project net BUCK EN1]
GND: C?#88.2 D?.1(C) TC?.5(GND) U?#9.N9(DXN_0) U?#9.N10(DXP_0) U?#9.U9(M2_0) U?#9.U10(M1_0) U?#10.3 U?#11.3 U?#12.10(VSS)  [also labelled M1_CONFIG, M2_CONFIG]  [project net BUCK AGND]
DONE: D?.2(A) R?#1.2 U?#9.G11(DONE_0)
INIT_N: R?#2.1 U?#9.U12(INIT_B_0)
JTAG_TCK: R?#9.1 U?#9.V12(TCK_0)
JTAG_TDI: R?#8.1 U?#9.R13(TDI_0)
JTAG_TDO: R?#10.1 U?#9.U13(TDO_0)
JTAG_TMS: R?#7.1 U?#9.T13(TMS_0)
PROGRAM_N: R?#3.2 U?#9.N12(PROGRAM_B_0)
QSPI_CLK: R?#4.1 U?#12.16(C)
QSPI_CS_N: R?#13.2 U?#12.7(S#)
QSPI_DQ0: U?#12.15(DQ0)
QSPI_DQ1: U?#12.8(DQ1)
QSPI_DQ2: R?#11.2 U?#12.9(W#/DQ2)
QSPI_DQ3: R?#12.2 U?#12.1(RESET#/HOLD#/DQ3)
QSPI_RST_N: U?#12.3(RESET#/NC)
XADCGND: C?#86.2 C?#87.2 U?#8.2(GND) U?#9.L9(VREFN_0) U?#9.L10(VP_0) U?#9.M9(VN_0)
NetR?#4_2: R?#4.2 U?#9.L12(CCLK_0)
NetR?#5_1: R?#5.1 R?#8.2 TC?.3(TDI) U?#11.2
NetR?#6_1: R?#6.1 R?#7.2 TC?.2(TMS) U?#11.1
NetR?#9_2: R?#9.2 TC?.4(TCK) U?#10.1
NetR?#10_2: R?#10.2 TC?.6(TDO) U?#10.2

Not connected (* = marked no-connect by the designer): U?#7 1(NC)* 5(NC)* 6(NC)*; Y?#1 1(OE) 2(GND) 3(OUT) 4(VDD)

### Layout directives
mark named JTAG: JTAG_TCK, JTAG_TDI, JTAG_TDO, JTAG_TMS
mark named QSPI Data: QSPI_DQ0, QSPI_DQ1, QSPI_DQ2, QSPI_DQ3

### Notes on the sheet
- UG470 Figure 2-14
- UG480 Figure 1-2 provides the XADC pinout
- UG470, Table 2-4 defines what each of the SPI flash pins on the FPGA are for
  UG470, Figure 2-14 shows an example configuration with pull-up resistor values
  UG908, Table 47 lists compatible SPI flash ICs
- All of the JTAG pins have internal pull ups, but a forum post recommended having external pull ups on TMS and TDI to avoid Boundary Scan mode.
- (near U?#9) VP_0 and VN_0 are external analog inputs, so I can ground them.
  See UG480 Figure 1-1.
- Configuration modes listed in Table 2-2 UG470
- XAPP586 - "Connect each mode pin (M[2..0]) either directly, or via a 1 kW (or stronger) resistor, to VCCO_0 or GND."
- (in symbol XC7A100T-1FGG484C, part H) BANK 0

### Library data of the parts
C?#86 C?#88 = CMP-13271-001945-1: as C?#3 on sheet 3_PowerDistribution
C?#87 = CMP-13271-000002-1: CL05A106MP5NUNC / CAP CER 10UF 10V X5R 0402; Manufacturer: Samsung; Temperature Coefficient: 15%; Tolerance: 20%; Material: Ceramic; Octopart: https://octopart.com/cl05a106mp5nunc-samsung-22457395; Voltage Rating: 10V; RoHS: TRUE; Value: 10uF; Height: 0.7mm; Digikey Description: CAP CER 10UF 10V X5R 0402; Automotive: No; Package: CL05A106MP5NUNC; Device Class L1: Passive Components; Capacitance: 10uF; Temperature Range High: +85°C; ComponentLink2Description: Datasheet; Device Class L2: Capacitors; Temperature Characteristic: X5R; Manufacturer Part Number: CL05A106MP5NUNC; Temperature: -55°C to +85°C; ComponentLink2URL: http://www.samsungsem.com/kr/support/product-search/mlcc/__icsFiles/afieldfile/2019/05/10/19-CL05A106MP5NUNC.pdf; Device Class L3: Ceramic Capacitors; Category: Cap; Temperature Range Low: -55°C; Ipc Land Pattern Name: CAPC10050X50; Lead Free: Yes
D? = CMP-08952-000005-1: SML-D12M1WT86 / LED YLW/GREEN DIFFUSED 1608 SMD; Manufacturer: Rohm; Led Orientation: Top View; Forward Voltage: 2.2V; Power Dissipation: 54mW; Wavelength: 572nm; Reverse Voltage: 5V; Forward Current: 20mA; Luminous Intensity: 30mcd; Manufacturer Part Number: SML-D12M1WT86; RoHS: TRUE; Package: SML-D12; Temperature Range Low: -40°C; Device Class L3: unset; Temperature Range High: +85°C; Device Class L2: LEDs; Category: Diode; Device Class L1: Optoelectronics; Digikey Description: LED YLW/GREEN DIFFUSED 1608 SMD; Temperature: -40°C to +85°C; ComponentLink2Description: Datasheet; Colour: Green; Automotive: No; Height: 0.65mm; Lead Free: Yes; Octopart: https://octopart.com/sml-d12m1wt86-rohm-70837112; ComponentLink2URL: https://www.rohm.com/datasheet/SML-D12M1W
R?#1 = CMP-1010-00062-1: 330R 0.05W 5% 0201 (0603 Metric)  SMD; Case-EIA: 0201; Value: 330.00 Ohm; Case-Metric: 0603; Tolerance: 5 %; Technology: SMT; Power: 0.05 W
R?#2 R?#3 R?#5 R?#6 R?#11-R?#13 = CMP-2004-00672-1: CRCW02014K70FNED; Manufacturer: Vishay Dale; Part Number: CRCW02014K70FNED
R?#4 R?#7-R?#10 = CMP-26527-003623-1: RMCF0201JG22R0 / 22Ω ±5% 0.05W 0201 Thick Film Chip Resistor AEC-Q200 compliant; Max Power Dissipation: 50mW; Resistance: 22R; Temperature Coefficient: 200ppm/°C; Length: 0.024inch; Height: 0.009inch; Max Operating Temperature: 125°C; Packaging: Tape and Reel; Number of Terminations: 2; Case/Package: 0201; Resistor Type: Thick Film; Width: 0.012inch; Case Code (Metric): 0603; Min Operating Temperature: -55°C; Case Code (Imperial): 0201; Tolerance: 5%
TC? = CMP-022-000000-2: PLUG-OF-NAILS 6-PIN W/ LEGS 8; MF: Tag-Connect LLC; MP: TC2030-IDC; Component Type: Standard; Source: TC2030-IDC Modified.SchLib; Pin Count: 6; Value: *; SnapEDA_Link: https://www.snapeda.com/parts/TC2030-IDC/Tag-Connect/view-part/?ref=snap; Package: None; Design Item ID: TC2030-IDC; Check_prices: https://www.snapeda.com/parts/TC2030-IDC/Tag-Connect/view-part/?ref=eda
U?#7 U?#8 = CMP-0784-00537-1: Precision, Micropower LDO Voltage Reference in TSOT, 1.25 V Output, 2.7 to 18 V Supply, Industrial, 6-pin SOT23 (UJ-6), Reel; Manufacturer: Analog Devices; Max V Supply (V): 18; Vout: 1.25V; Ref Out TC (ppm/C): 3; Min V Supply (V): 2.7; ComponentLink1URL: http://www.analog.com/en/index.html; PartNumber: ADR127BUJZ-REEL7; Operating Temp Range: -40 to 125 degC; ComponentLink4URL: Product URL:http://www.analog.com/en/special-linear-functions/voltage-references/adr127/products/product.html; ComponentLink1Description: Manufacturer URL; Code_JEDEC: MO-193-AA; Packing: Reel; ComponentLink3Description: Package Specification; ComponentLink2URL: http://www.analog.com/static/imported-files/data_sheets/ADR121_125_127.pdf; ComponentLink2Description: Datasheet; DatasheetVersion: Rev. B; Mounting Technology: Surface Mount; PackageReference: UJ-6; PackageDescription: 6-Pin Thin Small Outline Transistor Package, Body 2.9 x 1.6 mm, Pitch 0.95 mm; ComponentLink3URL: http://www.analog.com/static/imported-files/packages/PKG_PDF/TSOT(UJ)/UJ_6.pdf; ComponentLink4Description: URL Link1; PackageVersion: Dec-04
U?#9 = XC7A100T-1FGG484C: as U?#1 on sheet 3_PowerDistribution; Value: *; Check_prices: https://www.snapeda.com/parts/XC7A100T-1FGG484C/Xilinx/view-part/?ref=eda; MP: XC7A100T-1FGG484C; SnapEDA_Link: https://www.snapeda.com/parts/XC7A100T-1FGG484C/Xilinx/view-part/?ref=snap; Package: FBGA-484 Xilinx
U?#10 U?#11 = GSOT04C-HE3-08: ESD PROTECTION DIODE SOT23; Manufacturer_Name: Vishay; Type: Type; Datasheet: https://www.vishay.com/doc?85824; Manufacturer_Part_Number: GSOT04C-HE3-08; Copyright: Copyright (C) 2025 Ultra Librarian. All rights reserved.; RefDes: RefDes
U?#12 = CMP-2000-07603-1: Micron Serial NOR Flash Memory, 512 Mbits, 2.7 to 3.6 V, -40 to 85 degC, 16-Pin SOP2 (SF), RoHS; Operating Supply Voltage: 3V; Min Supply Voltage: 2.7V; Page Size: 256B; Access Time: 6ns; Max Supply Voltage: 3.6V; Frequency: 133MHz; Density: 512Mb; Datasheet URL: https://www.micron.com/~/media/documents/products/data-sheet/nor-flash/serial-nor/mt25q/die-rev-b/mt25q_qlkt_l_512_abb_0.pdf; Mounting Technology: SurfaceMount; Min Operating Temperature: -40degC; Package Reference: SF-16; Mount: SurfaceMount; Package Description: 16-Pin Small Outline Integrated Circuit Wide, Body 7.5 X 10.3 mm, Pitch 1.27 mm; Interface: Serial; Memory Type: FLASH; Datasheet Version: Rev. E, 06/2017; Manufacturer URL: http://www.micron.com/; RoHSCompliant: True; Manufacturer: Micron; Max Operating Temperature: 85degC
Y?#1 = CMP-25159-260204-1: MEMS OSC XO 100.0000MHZ H/LVCMOS; Frequency Stability: 50ppm; Frequency: 100MHz; Max Supply Current: 4.5mA; Width: 0.197inch; Height: 0.039inch; Packaging: Cut Tape; Max Operating Temperature: 85°C; RoHS Compliant: Yes; Length: 0.276inch; Case/Package: SMD/SMT; Mount: Surface Mount; Series: SIT8008; Min Operating Temperature: -40°C

## Sheet 5_GPIOBanks.SchDoc: GPIO Banks (13-16)
size Legal; Date: 12/27/2025; Author: Praveen Perera; DrawnBy: Praveen Perera; Engineer: Praveen Perera; Revision: 0; SheetNumber: 5; SheetTotal: 9
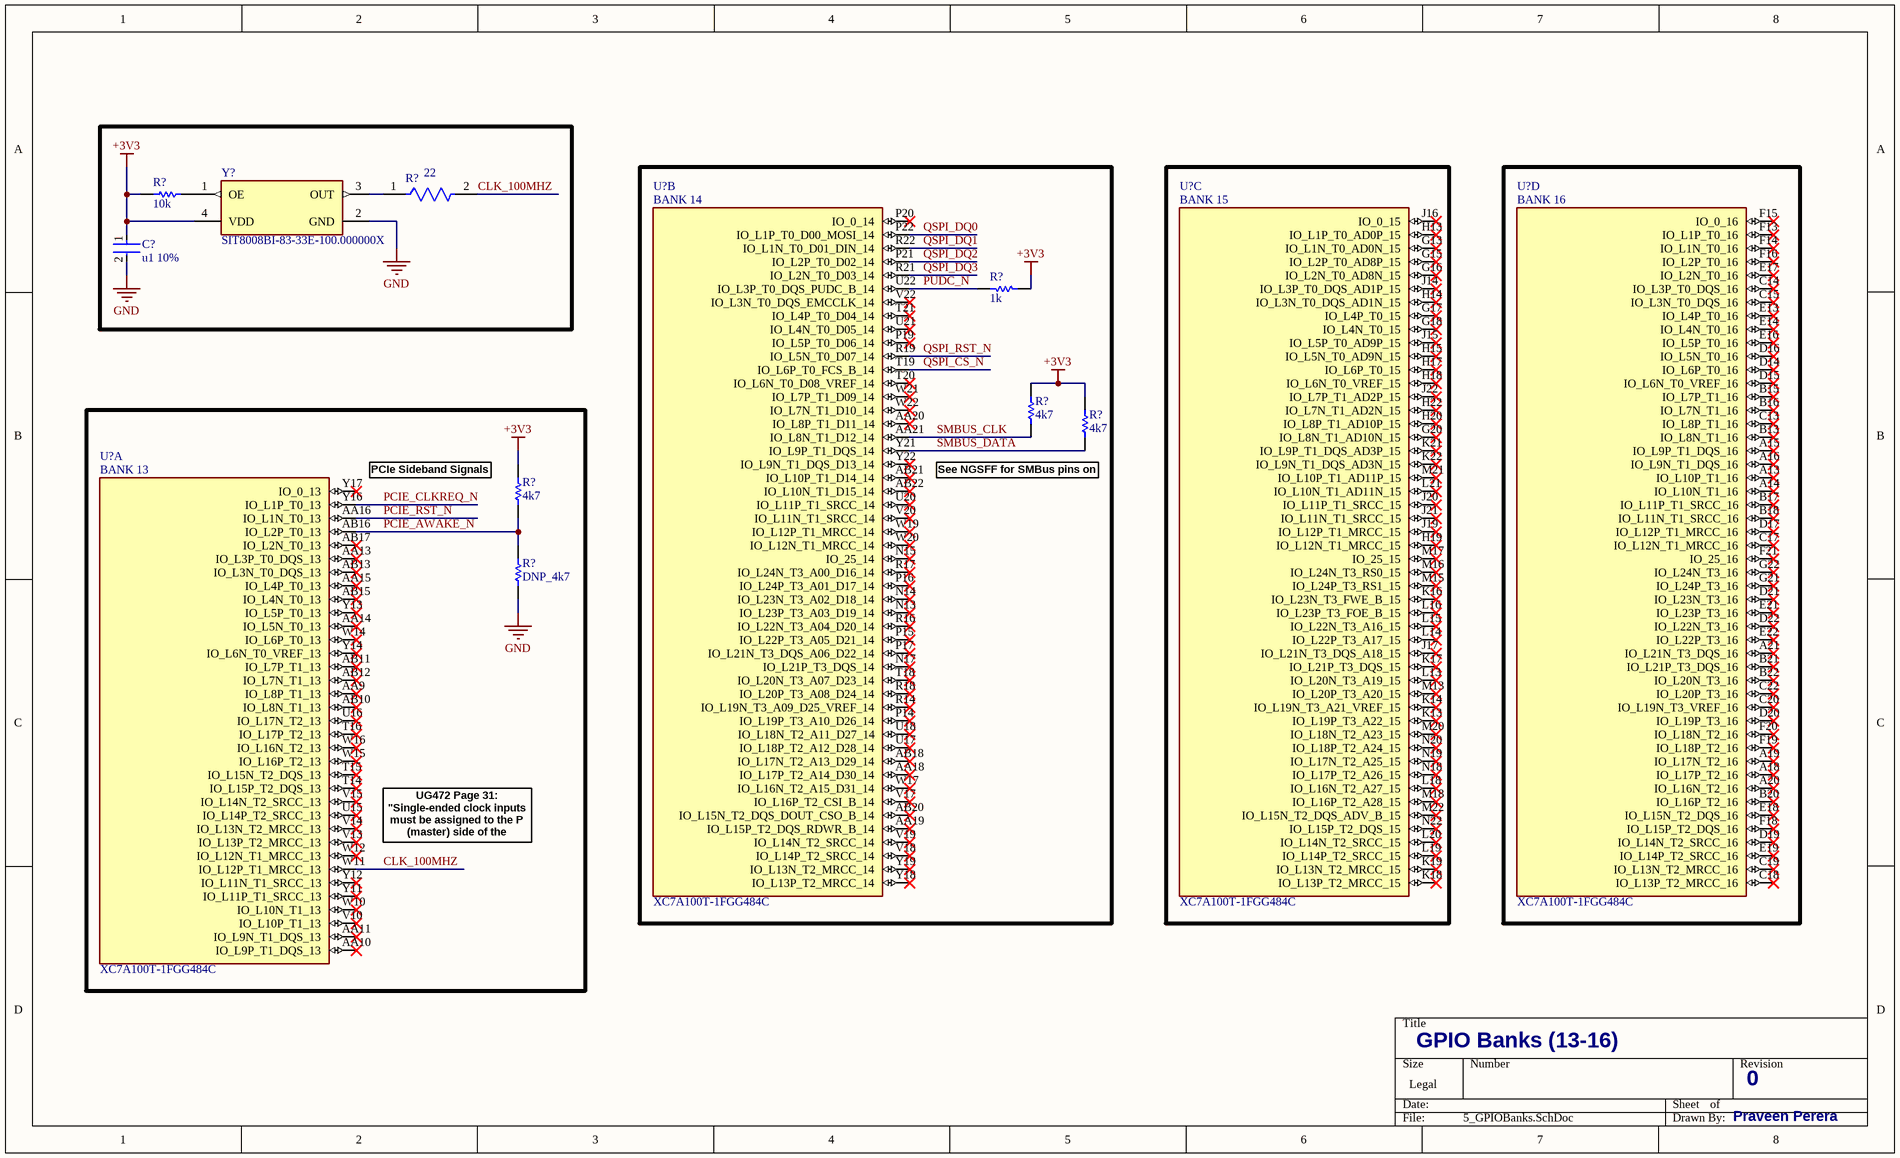
[diagram p3: 5_GPIOBanks.SchDoc]

### Parts
(Parts that share a designator on the sheet are numbered #1, #2 ... from top to bottom, then left to right.)
C?#89  u1 10%  [FP-CL891-IPC_C]
R?#14  10k  [RESC1005X40X25LL10T10]
R?#15  22  [FP-RMCF0201-IPC_C]
R?#16  1k  [RESC0603X28X15ML05T05]
R?#17  4k7  [RESC0603X28X15NL05T05]
R?#18  4k7  [RESC0603X28X15NL05T05]
R?#19  4k7  [RESC0603X28X15NL05T05]
R?#20  DNP_4k7  [RESC0603X28X15NL05T05]
U?#13  XC7A100T-1FGG484C  [BGA484C100P22X22_2300X2300X260N]  (part B of 14)
U?#14  XC7A100T-1FGG484C  [BGA484C100P22X22_2300X2300X260N]  (part C of 14)
U?#15  XC7A100T-1FGG484C  [BGA484C100P22X22_2300X2300X260N]  (part D of 14)
U?#16  XC7A100T-1FGG484C  [BGA484C100P22X22_2300X2300X260N]  (part A of 14)
Y?#2  SIT8008BI-83-33E-100.000000X  [FP-SiT8008-8-MFG]

### Nets
+3V3: C?#89.1 R?#14.1 R?#16.1 R?#17.2 R?#18.2 R?#19.2 Y?#2.4(VDD)  [project net BUCK EN1]
GND: C?#89.2 R?#20.1 Y?#2.2(GND)  [project net BUCK AGND]
CLK_100MHZ: R?#15.2 U?#16.W11(IO_L12P_T1_MRCC_13)
PCIE_AWAKE_N: R?#19.1 R?#20.2 U?#16.AB16(IO_L2P_T0_13)
PCIE_CLKREQ_N: U?#16.Y16(IO_L1P_T0_13)
PCIE_RST_N: U?#16.AA16(IO_L1N_T0_13)
PUDC_N: R?#16.2 U?#13.U22(IO_L3P_T0_DQS_PUDC_B_14)
QSPI_CS_N: U?#13.T19(IO_L6P_T0_FCS_B_14)
QSPI_DQ0: U?#13.P22(IO_L1P_T0_D00_MOSI_14)
QSPI_DQ1: U?#13.R22(IO_L1N_T0_D01_DIN_14)
QSPI_DQ2: U?#13.P21(IO_L2P_T0_D02_14)
QSPI_DQ3: U?#13.R21(IO_L2N_T0_D03_14)
QSPI_RST_N: U?#13.R19(IO_L5N_T0_D07_14)
SMBUS_CLK: R?#17.1 U?#13.AA21(IO_L8N_T1_D12_14)
SMBUS_DATA: R?#18.1 U?#13.Y21(IO_L9P_T1_DQS_14)
NetR?#14_2: R?#14.2 Y?#2.1(OE)
NetR?#15_1: R?#15.1 Y?#2.3(OUT)

Not connected (* = marked no-connect by the designer): U?#13 AA18(IO_L17P_T2_A14_D30_14)* AA19(IO_L15P_T2_DQS_RDWR_B_14)* AA20(IO_L8P_T1_D11_14)* AB18(IO_L17N_T2_A13_D29_14)* AB20(IO_L15N_T2_DQS_DOUT_CSO_B_14)* AB21(IO_L10P_T1_D14_14)* AB22(IO_L10N_T1_D15_14)* N13(IO_L23P_T3_A03_D19_14)* N14(IO_L23N_T3_A02_D18_14)* N15(IO_25_14)* N17(IO_L21P_T3_DQS_14)* P14(IO_L19P_T3_A10_D26_14)* P15(IO_L22P_T3_A05_D21_14)* P16(IO_L24P_T3_A01_D17_14)* P17(IO_L21N_T3_DQS_A06_D22_14)* P19(IO_L5P_T0_D06_14)* P20(IO_0_14)* R14(IO_L19N_T3_A09_D25_VREF_14)* R16(IO_L22N_T3_A04_D20_14)* R17(IO_L24N_T3_A00_D16_14)* R18(IO_L20P_T3_A08_D24_14)* T18(IO_L20N_T3_A07_D23_14)* T20(IO_L6N_T0_D08_VREF_14)* T21(IO_L4P_T0_D04_14)* U17(IO_L18P_T2_A12_D28_14)* U18(IO_L18N_T2_A11_D27_14)* U20(IO_L11P_T1_SRCC_14)* U21(IO_L4N_T0_D05_14)* V17(IO_L16P_T2_CSI_B_14)* V18(IO_L14P_T2_SRCC_14)* V19(IO_L14N_T2_SRCC_14)* V20(IO_L11N_T1_SRCC_14)* V22(IO_L3N_T0_DQS_EMCCLK_14)* W17(IO_L16N_T2_A15_D31_14)* W19(IO_L12P_T1_MRCC_14)* W20(IO_L12N_T1_MRCC_14)* W21(IO_L7P_T1_D09_14)* W22(IO_L7N_T1_D10_14)* Y18(IO_L13P_T2_MRCC_14)* Y19(IO_L13N_T2_MRCC_14)* Y22(IO_L9N_T1_DQS_D13_14)*; U?#14 G13(IO_L1N_T0_AD0N_15)* G15(IO_L2P_T0_AD8P_15)* G16(IO_L2N_T0_AD8N_15)* G17(IO_L4P_T0_15)* G18(IO_L4N_T0_15)* G20(IO_L8N_T1_AD10N_15)* H13(IO_L1P_T0_AD0P_15)* H14(IO_L3N_T0_DQS_AD1N_15)* H15(IO_L5N_T0_AD9N_15)* H17(IO_L6P_T0_15)* H18(IO_L6N_T0_VREF_15)* H19(IO_L12N_T1_MRCC_15)* H20(IO_L8P_T1_AD10P_15)* H22(IO_L7N_T1_AD2N_15)* J14(IO_L3P_T0_DQS_AD1P_15)* J15(IO_L5P_T0_AD9P_15)* J16(IO_0_15)* J17(IO_L21N_T3_DQS_A18_15)* J19(IO_L12P_T1_MRCC_15)* J20(IO_L11P_T1_SRCC_15)* J21(IO_L11N_T1_SRCC_15)* J22(IO_L7P_T1_AD2P_15)* K13(IO_L19P_T3_A22_15)* K14(IO_L19N_T3_A21_VREF_15)* K16(IO_L23N_T3_FWE_B_15)* K17(IO_L21P_T3_DQS_15)* K18(IO_L13P_T2_MRCC_15)* K19(IO_L13N_T2_MRCC_15)* K21(IO_L9P_T1_DQS_AD3P_15)* K22(IO_L9N_T1_DQS_AD3N_15)* L13(IO_L20N_T3_A19_15)* L14(IO_L22P_T3_A17_15)* L15(IO_L22N_T3_A16_15)* L16(IO_L23P_T3_FOE_B_15)* L18(IO_L16N_T2_A27_15)* L19(IO_L14P_T2_SRCC_15)* L20(IO_L14N_T2_SRCC_15)* L21(IO_L10N_T1_AD11N_15)* M13(IO_L20P_T3_A20_15)* M15(IO_L24P_T3_RS1_15)* M16(IO_L24N_T3_RS0_15)* M17(IO_25_15)* M18(IO_L16P_T2_A28_15)* M20(IO_L18N_T2_A23_15)* M21(IO_L10P_T1_AD11P_15)* M22(IO_L15N_T2_DQS_ADV_B_15)* N18(IO_L17P_T2_A26_15)* N19(IO_L17N_T2_A25_15)* N20(IO_L18P_T2_A24_15)* N22(IO_L15P_T2_DQS_15)*; U?#15 A13(IO_L10P_T1_16)* A14(IO_L10N_T1_16)* A15(IO_L9P_T1_DQS_16)* A16(IO_L9N_T1_DQS_16)* A18(IO_L17P_T2_16)* A19(IO_L17N_T2_16)* A20(IO_L16N_T2_16)* A21(IO_L21N_T3_DQS_16)* B13(IO_L8N_T1_16)* B15(IO_L7P_T1_16)* B16(IO_L7N_T1_16)* B17(IO_L11P_T1_SRCC_16)* B18(IO_L11N_T1_SRCC_16)* B20(IO_L16P_T2_16)* B21(IO_L21P_T3_DQS_16)* B22(IO_L20N_T3_16)* C13(IO_L8P_T1_16)* C14(IO_L3P_T0_DQS_16)* C15(IO_L3N_T0_DQS_16)* C17(IO_L12N_T1_MRCC_16)* C18(IO_L13P_T2_MRCC_16)* C19(IO_L13N_T2_MRCC_16)* C20(IO_L19N_T3_VREF_16)* C22(IO_L20P_T3_16)* D14(IO_L6P_T0_16)* D15(IO_L6N_T0_VREF_16)* D16(IO_L5N_T0_16)* D17(IO_L12P_T1_MRCC_16)* D19(IO_L14N_T2_SRCC_16)* D20(IO_L19P_T3_16)* D21(IO_L23N_T3_16)* D22(IO_L22N_T3_16)* E13(IO_L4P_T0_16)* E14(IO_L4N_T0_16)* E16(IO_L5P_T0_16)* E17(IO_L2N_T0_16)* E18(IO_L15N_T2_DQS_16)* E19(IO_L14P_T2_SRCC_16)* E21(IO_L23P_T3_16)* E22(IO_L22P_T3_16)* F13(IO_L1P_T0_16)* F14(IO_L1N_T0_16)* F15(IO_0_16)* F16(IO_L2P_T0_16)* F18(IO_L15P_T2_DQS_16)* F19(IO_L18P_T2_16)* F20(IO_L18N_T2_16)* F21(IO_25_16)* G21(IO_L24P_T3_16)* G22(IO_L24N_T3_16)*; U?#16 AA9(IO_L8P_T1_13)* AA10(IO_L9P_T1_DQS_13)* AA11(IO_L9N_T1_DQS_13)* AA13(IO_L3P_T0_DQS_13)* AA14(IO_L5N_T0_13)* AA15(IO_L4P_T0_13)* AB10(IO_L8N_T1_13)* AB11(IO_L7P_T1_13)* AB12(IO_L7N_T1_13)* AB13(IO_L3N_T0_DQS_13)* AB15(IO_L4N_T0_13)* AB17(IO_L2N_T0_13)* T14(IO_L15P_T2_DQS_13)* T15(IO_L15N_T2_DQS_13)* T16(IO_L17P_T2_13)* U15(IO_L14P_T2_SRCC_13)* U16(IO_L17N_T2_13)* V10(IO_L10P_T1_13)* V13(IO_L13P_T2_MRCC_13)* V14(IO_L13N_T2_MRCC_13)* V15(IO_L14N_T2_SRCC_13)* W10(IO_L10N_T1_13)* W12(IO_L12N_T1_MRCC_13)* W14(IO_L6P_T0_13)* W15(IO_L16P_T2_13)* W16(IO_L16N_T2_13)* Y11(IO_L11P_T1_SRCC_13)* Y12(IO_L11N_T1_SRCC_13)* Y13(IO_L5P_T0_13)* Y14(IO_L6N_T0_VREF_13)* Y17(IO_0_13)*

### Notes on the sheet
- PCIe Sideband Signals
- (near R?#18) See NGSFF for SMBus pins on M.2
- UG472 Page 31: "Single-ended clock inputs must be assigned to the P (master) side of the clock-capable
  input pin pair."
- (in symbol XC7A100T-1FGG484C, part A) BANK 13
- (in symbol XC7A100T-1FGG484C, part B) BANK 14
- (in symbol XC7A100T-1FGG484C, part C) BANK 15
- (in symbol XC7A100T-1FGG484C, part D) BANK 16

### Library data of the parts
C?#89 = CMP-13271-001945-1: as C?#3 on sheet 3_PowerDistribution
R?#14 = CMP-2002-04584-1: SG73P1ETTP1002F; Manufacturer: KOA Speer; Part Number: SG73P1ETTP1002F
R?#15 = CMP-26527-003623-1: as R?#4 on sheet 4_Configuration; Length: 0.024inch; Height: 0.009inch; Max Operating Temperature: 125°C; Packaging: Tape and Reel; Number of Terminations: 2; Case/Package: 0201; Resistor Type: Thick Film; Width: 0.012inch; Case Code (Metric): 0603; Min Operating Temperature: -55°C; Case Code (Imperial): 0201; Tolerance: 5%
R?#16 = CMP-1010-00074-2: CRCW02011K00JNED; Manufacturer: Vishay Dale; Part Number: CRCW02011K00JNED
R?#17-R?#20 = CMP-2004-00672-1: as R?#2 on sheet 4_Configuration; Part Number: CRCW02014K70FNED
U?#13-U?#16 = XC7A100T-1FGG484C: as U?#1 on sheet 3_PowerDistribution; Value: *; Check_prices: https://www.snapeda.com/parts/XC7A100T-1FGG484C/Xilinx/view-part/?ref=eda; MP: XC7A100T-1FGG484C; SnapEDA_Link: https://www.snapeda.com/parts/XC7A100T-1FGG484C/Xilinx/view-part/?ref=snap; Package: FBGA-484 Xilinx
Y?#2 = CMP-00000-2: Oscillator MEMS 100MHz ±50ppm (Stability) 15pF HCMOS/LVCMOS 55% 3.3V Medical 4-Pin QFN SMD T/R; Max Supply Voltage: 3.63V; Nominal Supply Current: 3.8mA; Max Junction Temperature (Tj): 150°C; Fall Time: 2ns; Low Level Output Current: 4mA; Max Supply Current: 4.5mA; Min Supply Voltage: 2.97V; Min Operating Temperature: -40°C; Width: 5.0038mm; Operating Supply Voltage: 3.3V; Length: 7.0104mm; Height: 1.05mm; Lifecycle Status: Production; Max Operating Temperature: 85°C; Number of Terminals: 4; REACH SVHC: Yes; Rise Time: 2ns; Load Capacitance: 15pF; Mounting Technology: Surface Mount; Case/Package: SMD/SMT; RoHS: Compliant; Frequency Stability: 50ppm; Frequency: 100MHz

## Sheet 6_DRAMBanks.SchDoc: DRAM Signals (Banks 34-35)
size Letter; Date: 12/28/2025; Author: Praveen Perera; DrawnBy: Praveen Perera; Engineer: Praveen Perera; Revision: 0; SheetNumber: 6; SheetTotal: 8
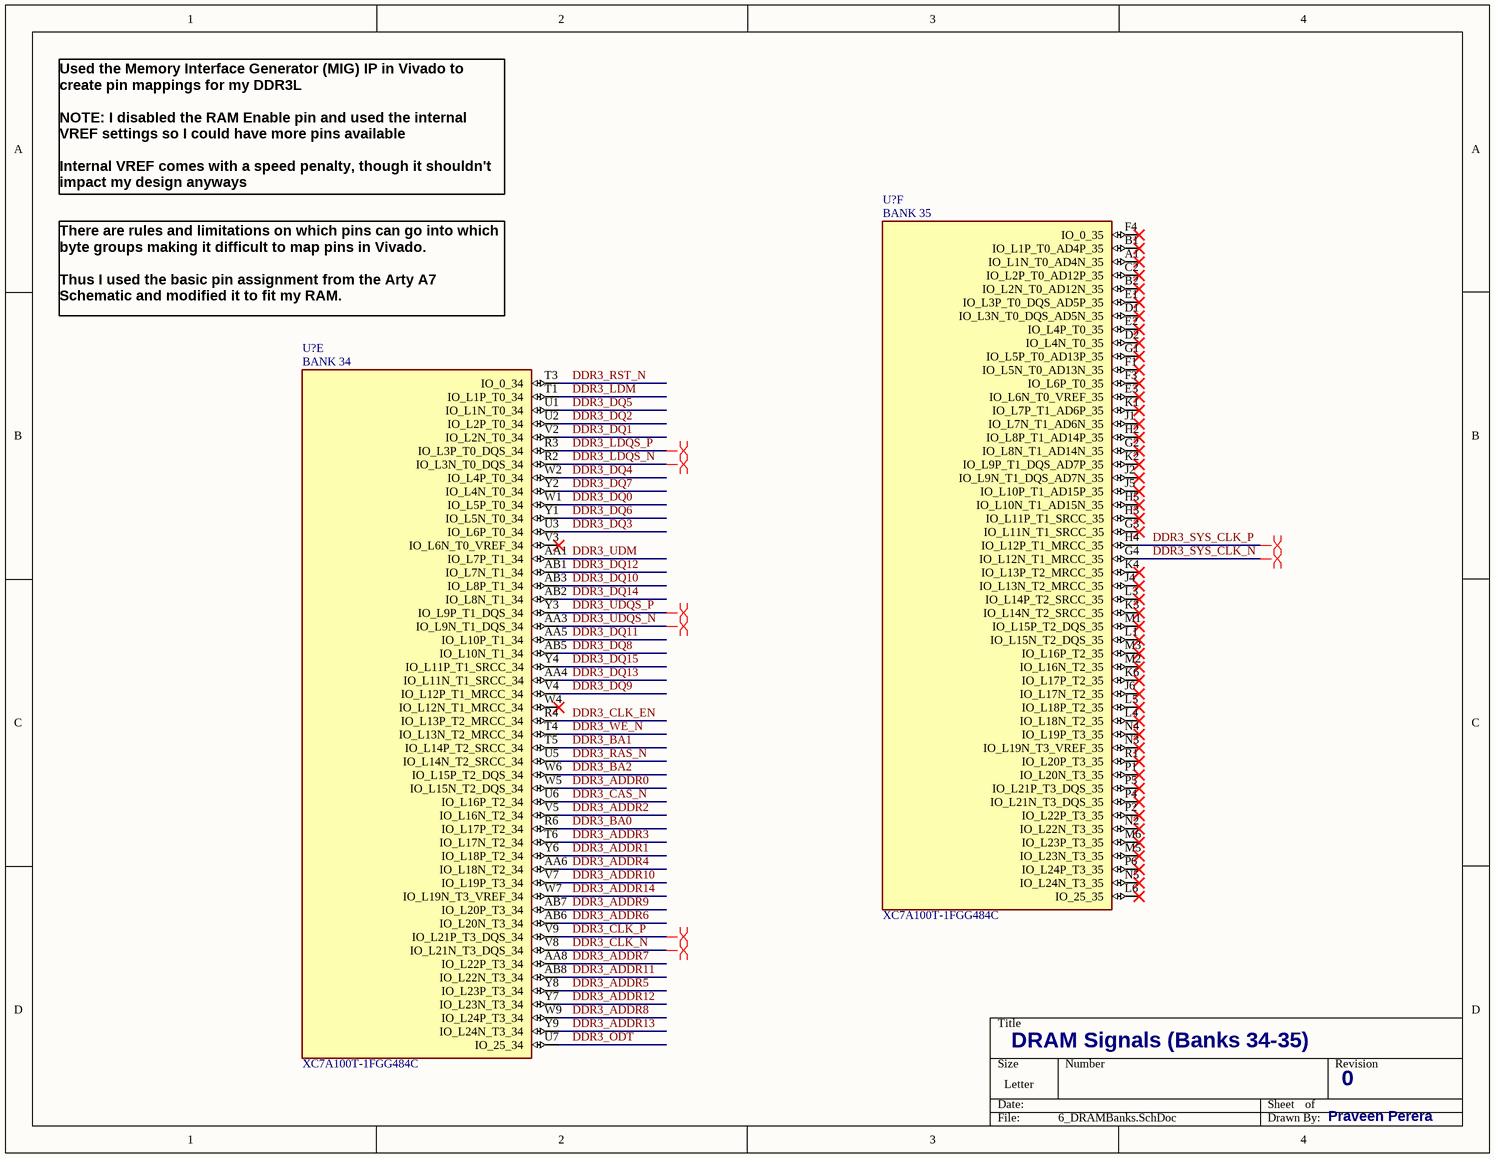
[diagram p4: 6_DRAMBanks.SchDoc]

### Parts
(Parts that share a designator on the sheet are numbered #1, #2 ... from top to bottom, then left to right.)
U?#17  XC7A100T-1FGG484C  [BGA484C100P22X22_2300X2300X260N]  (part F of 14)
U?#18  XC7A100T-1FGG484C  [BGA484C100P22X22_2300X2300X260N]  (part E of 14)

### Nets
DDR3_ADDR0: U?#18.W5(IO_L15N_T2_DQS_34)
DDR3_ADDR1: U?#18.Y6(IO_L18P_T2_34)
DDR3_ADDR2: U?#18.V5(IO_L16N_T2_34)
DDR3_ADDR3: U?#18.T6(IO_L17N_T2_34)
DDR3_ADDR4: U?#18.AA6(IO_L18N_T2_34)
DDR3_ADDR5: U?#18.Y8(IO_L23P_T3_34)
DDR3_ADDR6: U?#18.AB6(IO_L20N_T3_34)
DDR3_ADDR7: U?#18.AA8(IO_L22P_T3_34)
DDR3_ADDR8: U?#18.W9(IO_L24P_T3_34)
DDR3_ADDR9: U?#18.AB7(IO_L20P_T3_34)
DDR3_ADDR10: U?#18.V7(IO_L19P_T3_34)
DDR3_ADDR11: U?#18.AB8(IO_L22N_T3_34)
DDR3_ADDR12: U?#18.Y7(IO_L23N_T3_34)
DDR3_ADDR13: U?#18.Y9(IO_L24N_T3_34)
DDR3_ADDR14: U?#18.W7(IO_L19N_T3_VREF_34)
DDR3_BA0: U?#18.R6(IO_L17P_T2_34)
DDR3_BA1: U?#18.T5(IO_L14P_T2_SRCC_34)
DDR3_BA2: U?#18.W6(IO_L15P_T2_DQS_34)
DDR3_CAS_N: U?#18.U6(IO_L16P_T2_34)
DDR3_CLK_EN: U?#18.R4(IO_L13P_T2_MRCC_34)
DDR3_CLK_N: U?#18.V8(IO_L21N_T3_DQS_34)
DDR3_CLK_P: U?#18.V9(IO_L21P_T3_DQS_34)
DDR3_DQ0: U?#18.W1(IO_L5P_T0_34)
DDR3_DQ1: U?#18.V2(IO_L2N_T0_34)
DDR3_DQ2: U?#18.U2(IO_L2P_T0_34)
DDR3_DQ3: U?#18.U3(IO_L6P_T0_34)
DDR3_DQ4: U?#18.W2(IO_L4P_T0_34)
DDR3_DQ5: U?#18.U1(IO_L1N_T0_34)
DDR3_DQ6: U?#18.Y1(IO_L5N_T0_34)
DDR3_DQ7: U?#18.Y2(IO_L4N_T0_34)
DDR3_DQ8: U?#18.AB5(IO_L10N_T1_34)
DDR3_DQ9: U?#18.V4(IO_L12P_T1_MRCC_34)
DDR3_DQ10: U?#18.AB3(IO_L8P_T1_34)
DDR3_DQ11: U?#18.AA5(IO_L10P_T1_34)
DDR3_DQ12: U?#18.AB1(IO_L7N_T1_34)
DDR3_DQ13: U?#18.AA4(IO_L11N_T1_SRCC_34)
DDR3_DQ14: U?#18.AB2(IO_L8N_T1_34)
DDR3_DQ15: U?#18.Y4(IO_L11P_T1_SRCC_34)
DDR3_LDM: U?#18.T1(IO_L1P_T0_34)
DDR3_LDQS_N: U?#18.R2(IO_L3N_T0_DQS_34)
DDR3_LDQS_P: U?#18.R3(IO_L3P_T0_DQS_34)
DDR3_ODT: U?#18.U7(IO_25_34)
DDR3_RAS_N: U?#18.U5(IO_L14N_T2_SRCC_34)
DDR3_RST_N: U?#18.T3(IO_0_34)
DDR3_SYS_CLK_N: U?#17.G4(IO_L12N_T1_MRCC_35)
DDR3_SYS_CLK_P: U?#17.H4(IO_L12P_T1_MRCC_35)
DDR3_UDM: U?#18.AA1(IO_L7P_T1_34)
DDR3_UDQS_N: U?#18.AA3(IO_L9N_T1_DQS_34)
DDR3_UDQS_P: U?#18.Y3(IO_L9P_T1_DQS_34)
DDR3_WE_N: U?#18.T4(IO_L13N_T2_MRCC_34)

Not connected (* = marked no-connect by the designer): U?#17 A1(IO_L1N_T0_AD4N_35)* B1(IO_L1P_T0_AD4P_35)* B2(IO_L2N_T0_AD12N_35)* C2(IO_L2P_T0_AD12P_35)* D1(IO_L3N_T0_DQS_AD5N_35)* D2(IO_L4N_T0_35)* E1(IO_L3P_T0_DQS_AD5P_35)* E2(IO_L4P_T0_35)* E3(IO_L6N_T0_VREF_35)* F1(IO_L5N_T0_AD13N_35)* F3(IO_L6P_T0_35)* F4(IO_0_35)* G1(IO_L5P_T0_AD13P_35)* G2(IO_L8N_T1_AD14N_35)* G3(IO_L11N_T1_SRCC_35)* H2(IO_L8P_T1_AD14P_35)* H3(IO_L11P_T1_SRCC_35)* H5(IO_L10N_T1_AD15N_35)* J1(IO_L7N_T1_AD6N_35)* J2(IO_L9N_T1_DQS_AD7N_35)* J4(IO_L13N_T2_MRCC_35)* J5(IO_L10P_T1_AD15P_35)* J6(IO_L17N_T2_35)* K1(IO_L7P_T1_AD6P_35)* K2(IO_L9P_T1_DQS_AD7P_35)* K3(IO_L14N_T2_SRCC_35)* K4(IO_L13P_T2_MRCC_35)* K6(IO_L17P_T2_35)* L1(IO_L15N_T2_DQS_35)* L3(IO_L14P_T2_SRCC_35)* L4(IO_L18N_T2_35)* L5(IO_L18P_T2_35)* L6(IO_25_35)* M1(IO_L15P_T2_DQS_35)* M2(IO_L16N_T2_35)* M3(IO_L16P_T2_35)* M5(IO_L23N_T3_35)* M6(IO_L23P_T3_35)* N2(IO_L22N_T3_35)* N3(IO_L19N_T3_VREF_35)* N4(IO_L19P_T3_35)* N5(IO_L24N_T3_35)* P1(IO_L20N_T3_35)* P2(IO_L22P_T3_35)* P4(IO_L21N_T3_DQS_35)* P5(IO_L21P_T3_DQS_35)* P6(IO_L24P_T3_35)* R1(IO_L20P_T3_35)*; U?#18 V3(IO_L6N_T0_VREF_34)* W4(IO_L12N_T1_MRCC_34)*

### Layout directives
differential pair: DDR3_CLK_N, DDR3_CLK_P, DDR3_LDQS_N, DDR3_LDQS_P, DDR3_SYS_CLK_N, DDR3_SYS_CLK_P, DDR3_UDQS_N, DDR3_UDQS_P

### Notes on the sheet
- Used the Memory Interface Generator (MIG) IP in Vivado to create pin mappings for my DDR3L
  NOTE: I disabled the RAM Enable pin and used the internal VREF settings so I could have more pins available
  Internal VREF comes with a speed penalty, though it shouldn't impact my design anyways
- There are rules and limitations on which pins can go into which byte groups making it difficult to map pins in Vivado.
  Thus I used the basic pin assignment from the Arty A7 Schematic and modified it to fit my RAM.
- (in symbol XC7A100T-1FGG484C, part E) BANK 34
- (in symbol XC7A100T-1FGG484C, part F) BANK 35

### Library data of the parts
U?#17 U?#18 = XC7A100T-1FGG484C: as U?#1 on sheet 3_PowerDistribution; Value: *; Check_prices: https://www.snapeda.com/parts/XC7A100T-1FGG484C/Xilinx/view-part/?ref=eda; MP: XC7A100T-1FGG484C; SnapEDA_Link: https://www.snapeda.com/parts/XC7A100T-1FGG484C/Xilinx/view-part/?ref=snap; Package: FBGA-484 Xilinx

## Sheet 7_PCIeBank.SchDoc
size A; SheetNumber: 8; SheetTotal: 9
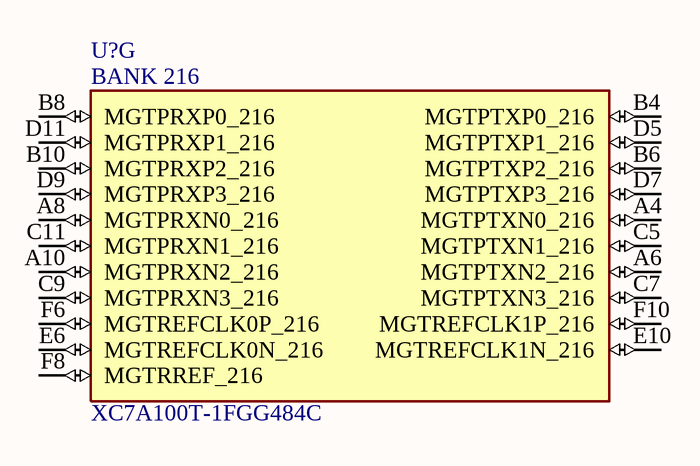
[diagram p5: 7_PCIeBank.SchDoc]

### Parts
(Parts that share a designator on the sheet are numbered #1, #2 ... from top to bottom, then left to right.)
U?#19  XC7A100T-1FGG484C  [BGA484C100P22X22_2300X2300X260N]  (part G of 14)

### Nets

Not connected (* = marked no-connect by the designer): U?#19 A4(MGTPTXN0_216) A6(MGTPTXN2_216) A8(MGTPRXN0_216) A10(MGTPRXN2_216) B4(MGTPTXP0_216) B6(MGTPTXP2_216) B8(MGTPRXP0_216) B10(MGTPRXP2_216) C5(MGTPTXN1_216) C7(MGTPTXN3_216) C9(MGTPRXN3_216) C11(MGTPRXN1_216) D5(MGTPTXP1_216) D7(MGTPTXP3_216) D9(MGTPRXP3_216) D11(MGTPRXP1_216) E6(MGTREFCLK0N_216) E10(MGTREFCLK1N_216) F6(MGTREFCLK0P_216) F8(MGTRREF_216) F10(MGTREFCLK1P_216)

### Notes on the sheet
- (in symbol XC7A100T-1FGG484C, part G) BANK 216

### Library data of the parts
U?#19 = XC7A100T-1FGG484C: as U?#1 on sheet 3_PowerDistribution; Value: *; Check_prices: https://www.snapeda.com/parts/XC7A100T-1FGG484C/Xilinx/view-part/?ref=eda; MP: XC7A100T-1FGG484C; SnapEDA_Link: https://www.snapeda.com/parts/XC7A100T-1FGG484C/Xilinx/view-part/?ref=snap; Package: FBGA-484 Xilinx

## Sheet 8_DDR3L.SchDoc
size A; SheetNumber: 8; SheetTotal: 9
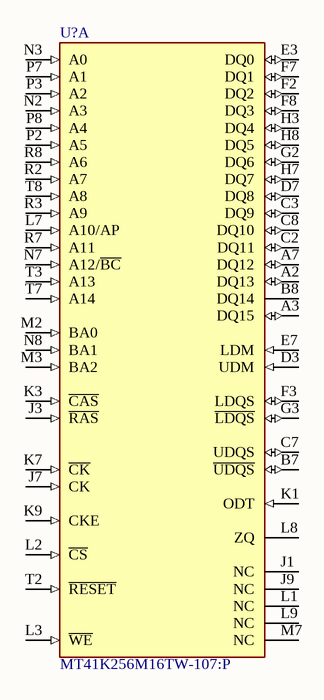
[diagram p6: 8_DDR3L.SchDoc]

### Parts
(Parts that share a designator on the sheet are numbered #1, #2 ... from top to bottom, then left to right.)
U?#20  MT41K256M16TW-107:P  [FP-TW-IPC_C]  (part A of 2)

### Nets

Not connected (* = marked no-connect by the designer): U?#20 A2(DQ13) A3(DQ15) A7(DQ12) B7(~{UDQS}) B8(DQ14) C2(DQ11) C3(DQ9) C7(UDQS) C8(DQ10) D3(UDM) D7(DQ8) E3(DQ0) E7(LDM) F2(DQ2) F3(LDQS) F7(DQ1) F8(DQ3) G2(DQ6) G3(~{LDQS}) H3(DQ4) H7(DQ7) H8(DQ5) J1(NC) J3(~{RAS}) J7(CK) J9(NC) K1(ODT) K3(~{CAS}) K7(~{CK}) K9(CKE) L1(NC) L2(~{CS}) L3(~{WE}) L7(A10/AP) L8(ZQ) L9(NC) M2(BA0) M3(BA2) M7(NC) N2(A3) N3(A0) N7(A12/~{BC}) N8(BA1) P2(A5) P3(A2) P7(A1) P8(A4) R2(A7) R3(A9) R7(A11) R8(A6) T2(~{RESET}) T3(A13) T7(A14) T8(A8)

### Library data of the parts
U?#20 = CMP-2000-07475-2: IC DRAM 4G PARALLEL 96FBGA; Manufacturer: Micron; Access Time: 1.07ns; Nominal Supply Current: 12-156mA; Description: DRAM Chip DDR3L SDRAM 4G-Bit 256Mx16 1.35V 96-Pin F-BGA; Min Supply Voltage: 1.283V; Memory Type: SDRAM,DDR3; Standoff Height: 0.29mm; Max Supply Voltage: 1.45V; Memory Size: 4Gbits; Device Class L1: Integrated Circuits (ICs); Lead Free: Yes; ComponentLink2Description: Datasheet; Manufacturer Part Number: MT41K256M16TW-107:P; Category: IC; Digikey Description: IC DRAM 4G PARALLEL 96FBGA; Device Class L3: RAM; Interface: Parallel; RoHS: TRUE; Octopart: https://octopart.com/mt41k256m16tw-107%3Ap-micron-66533852; Temperature Range High: +85°C; ComponentLink2URL: https://www.micron.com/-/media/client/global/documents/products/data-sheet/dram/ddr3/4gb_ddr3l.pdf; Temperature: 0°C to +85°C; Package: TW; Device Class L2: Memory; Automotive: No; Height: 1.2mm; Temperature Range Low: 0°C

## Sheet 9_M.2_B+M.SchDoc
size A; SheetNumber: 9; SheetTotal: 9
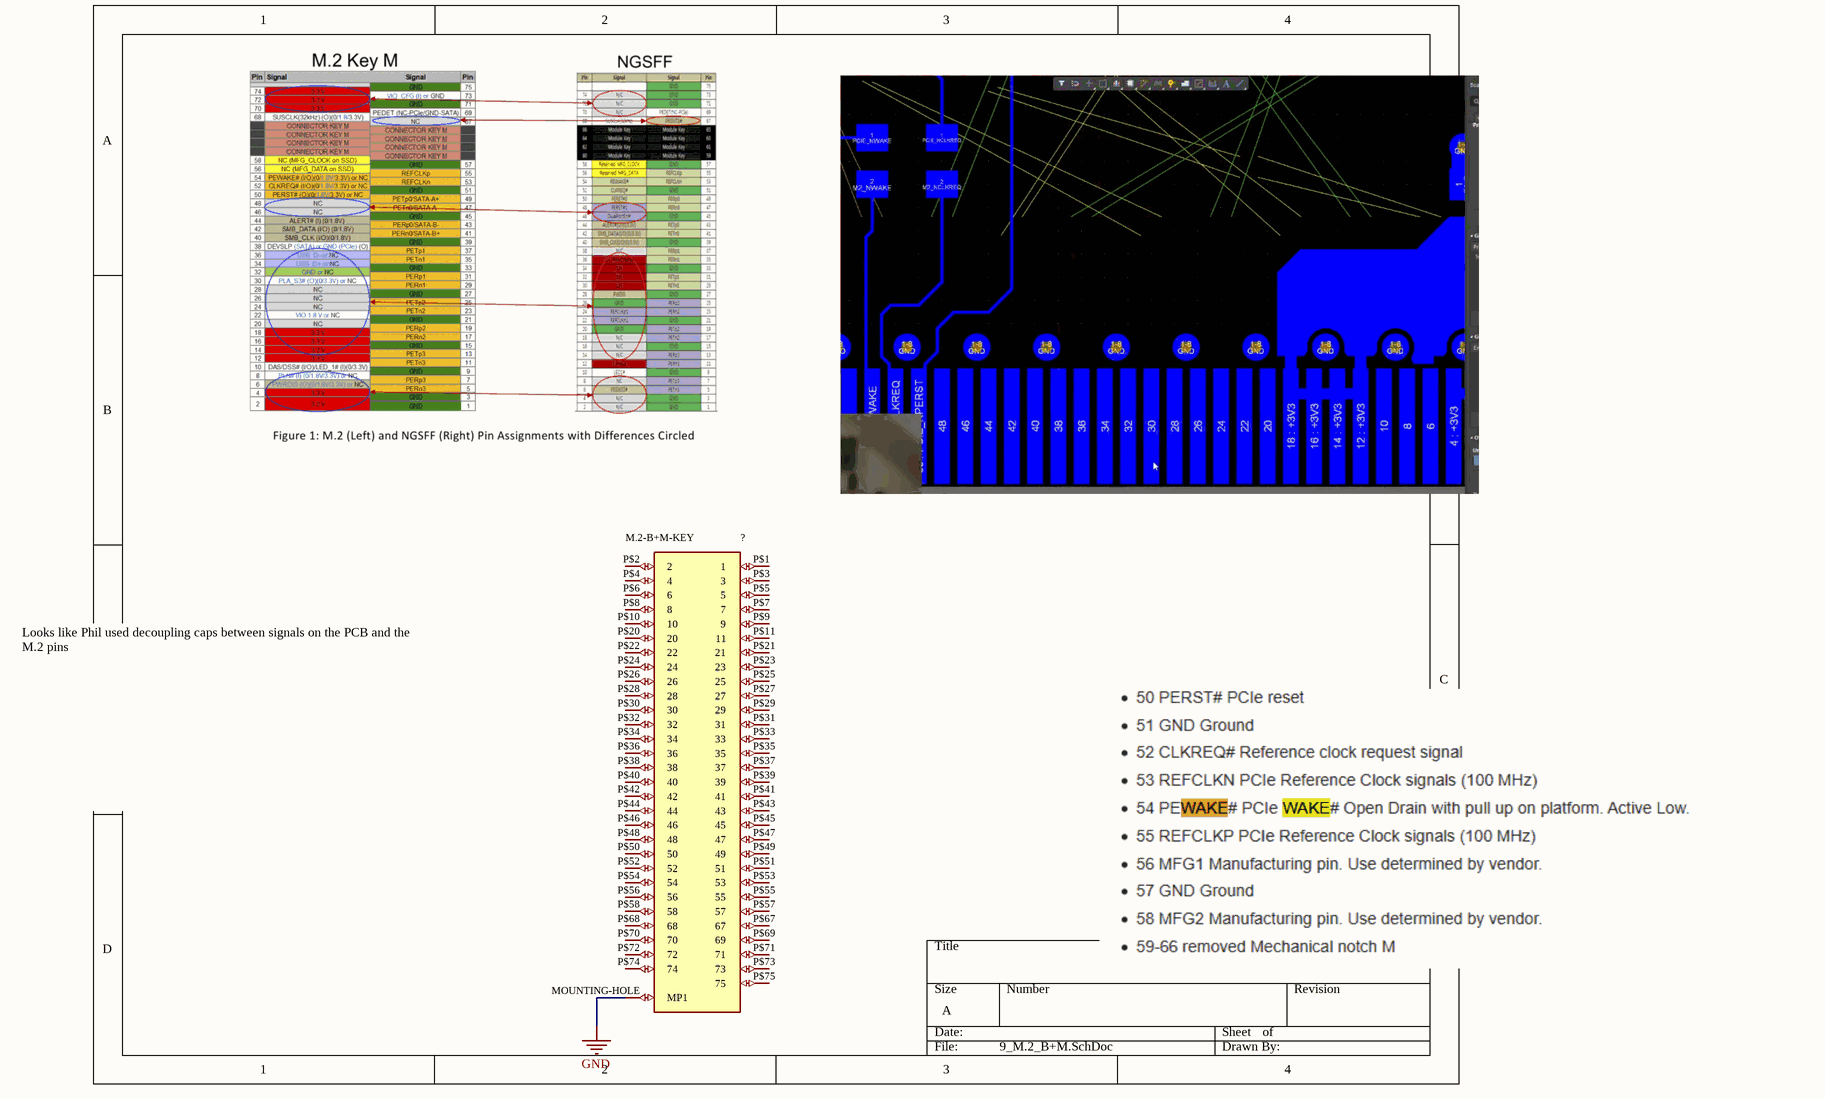
[diagram p7: 9_M.2_B+M.SchDoc]

### Parts
?  M.2-B+M-KEY  [M-2-B+M-KEY]

### Nets
GND: ?.MOUNTING-HOLE(MP1)  [project net BUCK AGND]

Not connected (* = marked no-connect by the designer): ? P$1(1) P$2(2) P$3(3) P$4(4) P$5(5) P$6(6) P$7(7) P$8(8) P$9(9) P$10(10) P$11(11) P$20(20) P$21(21) P$22(22) P$23(23) P$24(24) P$25(25) P$26(26) P$27(27) P$28(28) P$29(29) P$30(30) P$31(31) P$32(32) P$33(33) P$34(34) P$35(35) P$36(36) P$37(37) P$38(38) P$39(39) P$40(40) P$41(41) P$42(42) P$43(43) P$44(44) P$45(45) P$46(46) P$47(47) P$48(48) P$49(49) P$50(50) P$51(51) P$52(52) P$53(53) P$54(54) P$55(55) P$56(56) P$57(57) P$58(58) P$67(67) P$68(68) P$69(69) P$70(70) P$71(71) P$72(72) P$73(73) P$74(74) P$75(75)

### Notes on the sheet
- Looks like Phil used decoupling caps between signals on the PCB and the M.2 pins

### Library data of the parts
? = CMP-026-000000-1: GateName_1: G$1; Package: M.2-B+M-KEY; Source: M.Schlib; Component Type: Standard; SymbolName_1: M.2-B+M-KEY; LibraryName: M.2-Templates; Pin Count: 60; DeviceSetName: M.2-B+M-KEY; Design Item ID: M.2-B+M-KEY